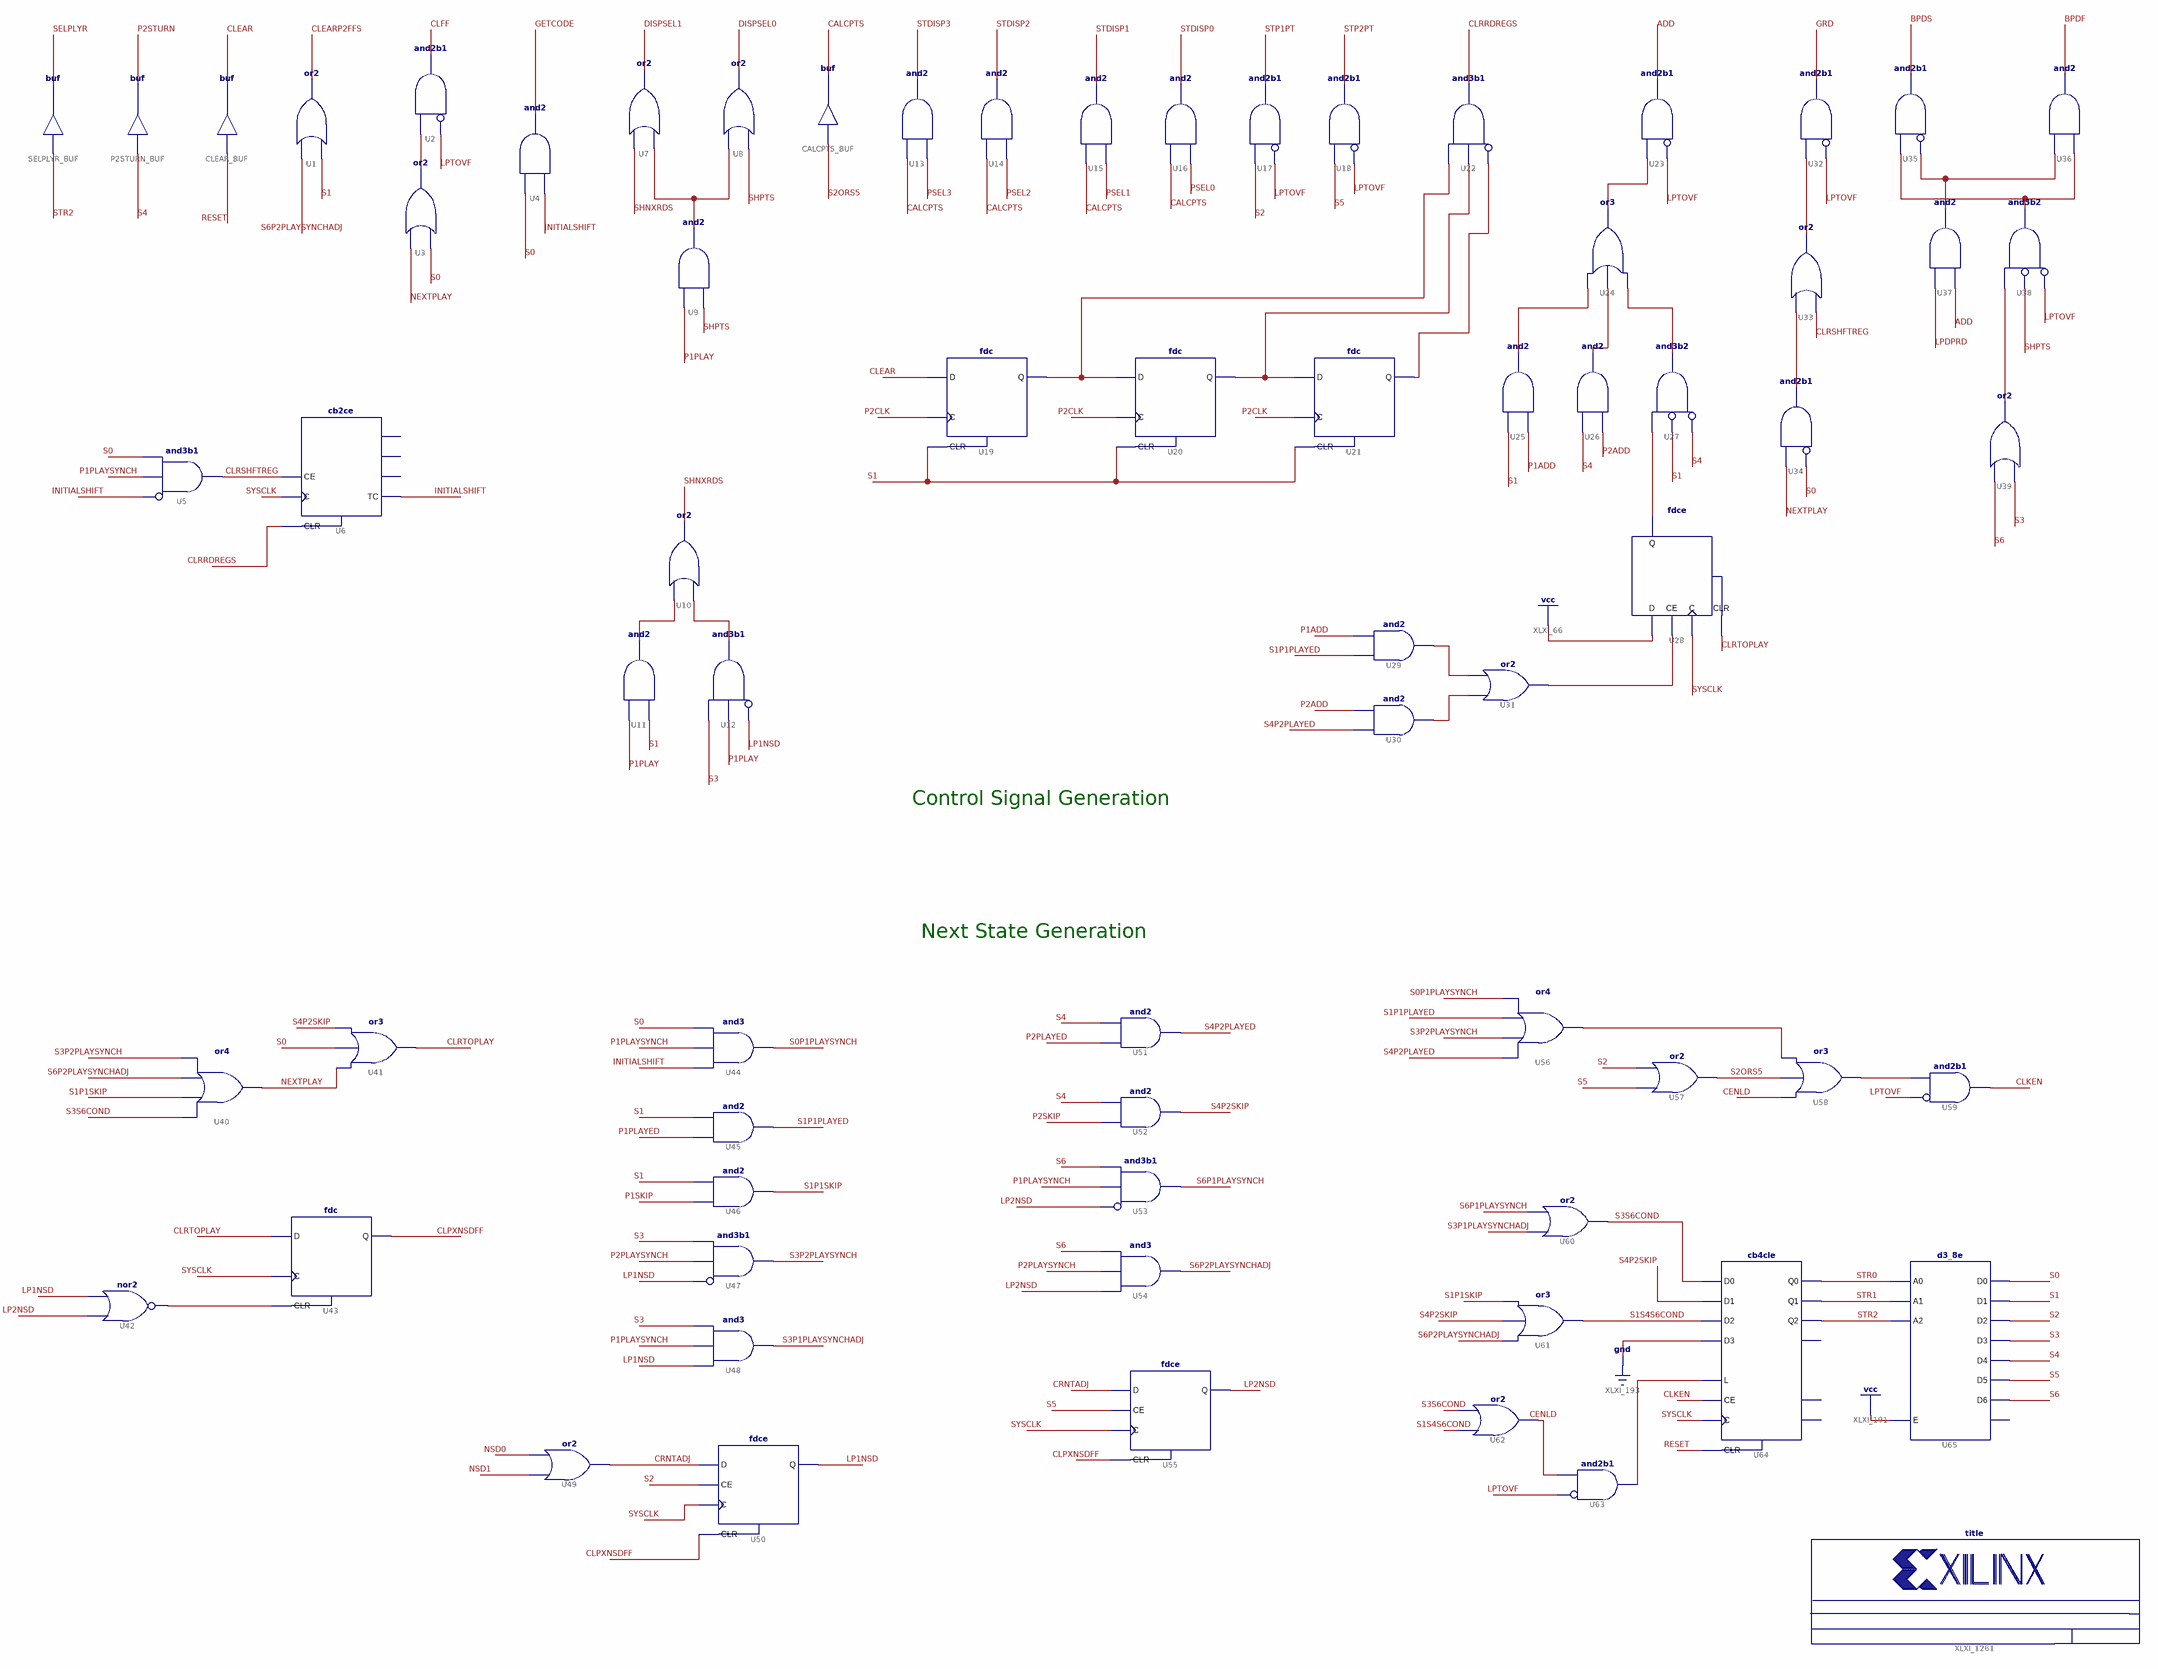
[diagram p0: schematic sheet 1]
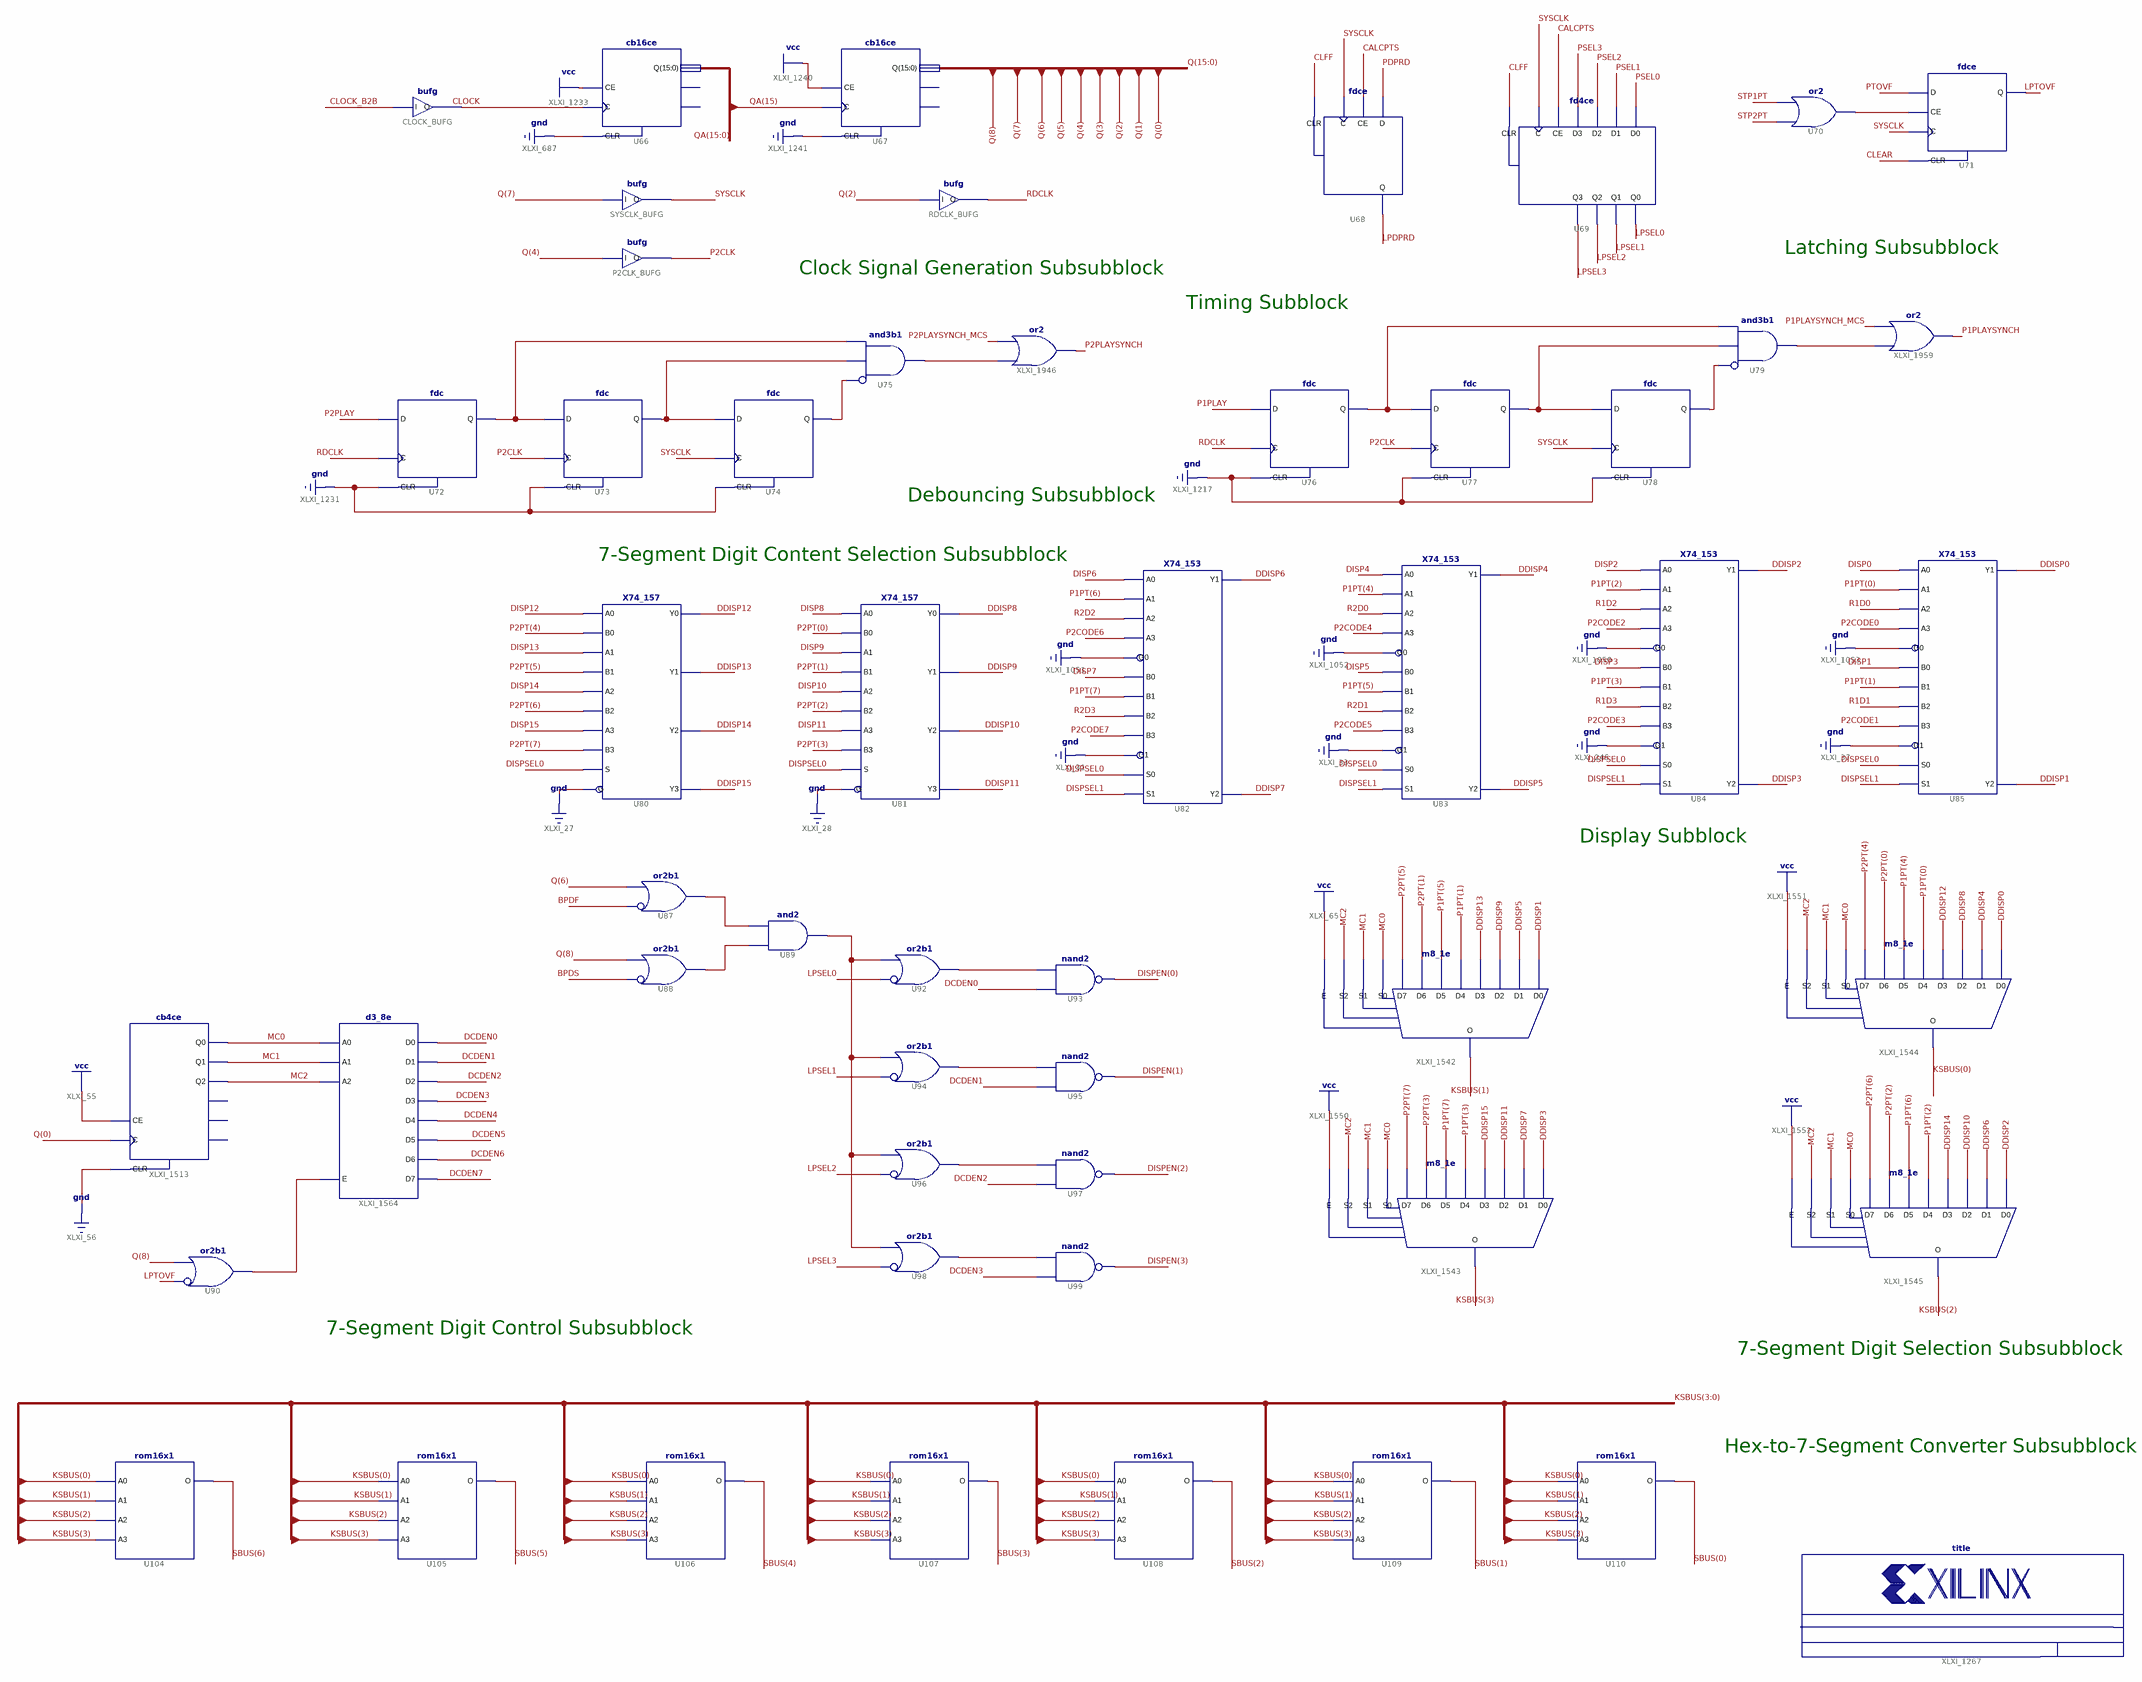
[diagram p1: schematic sheet 2]
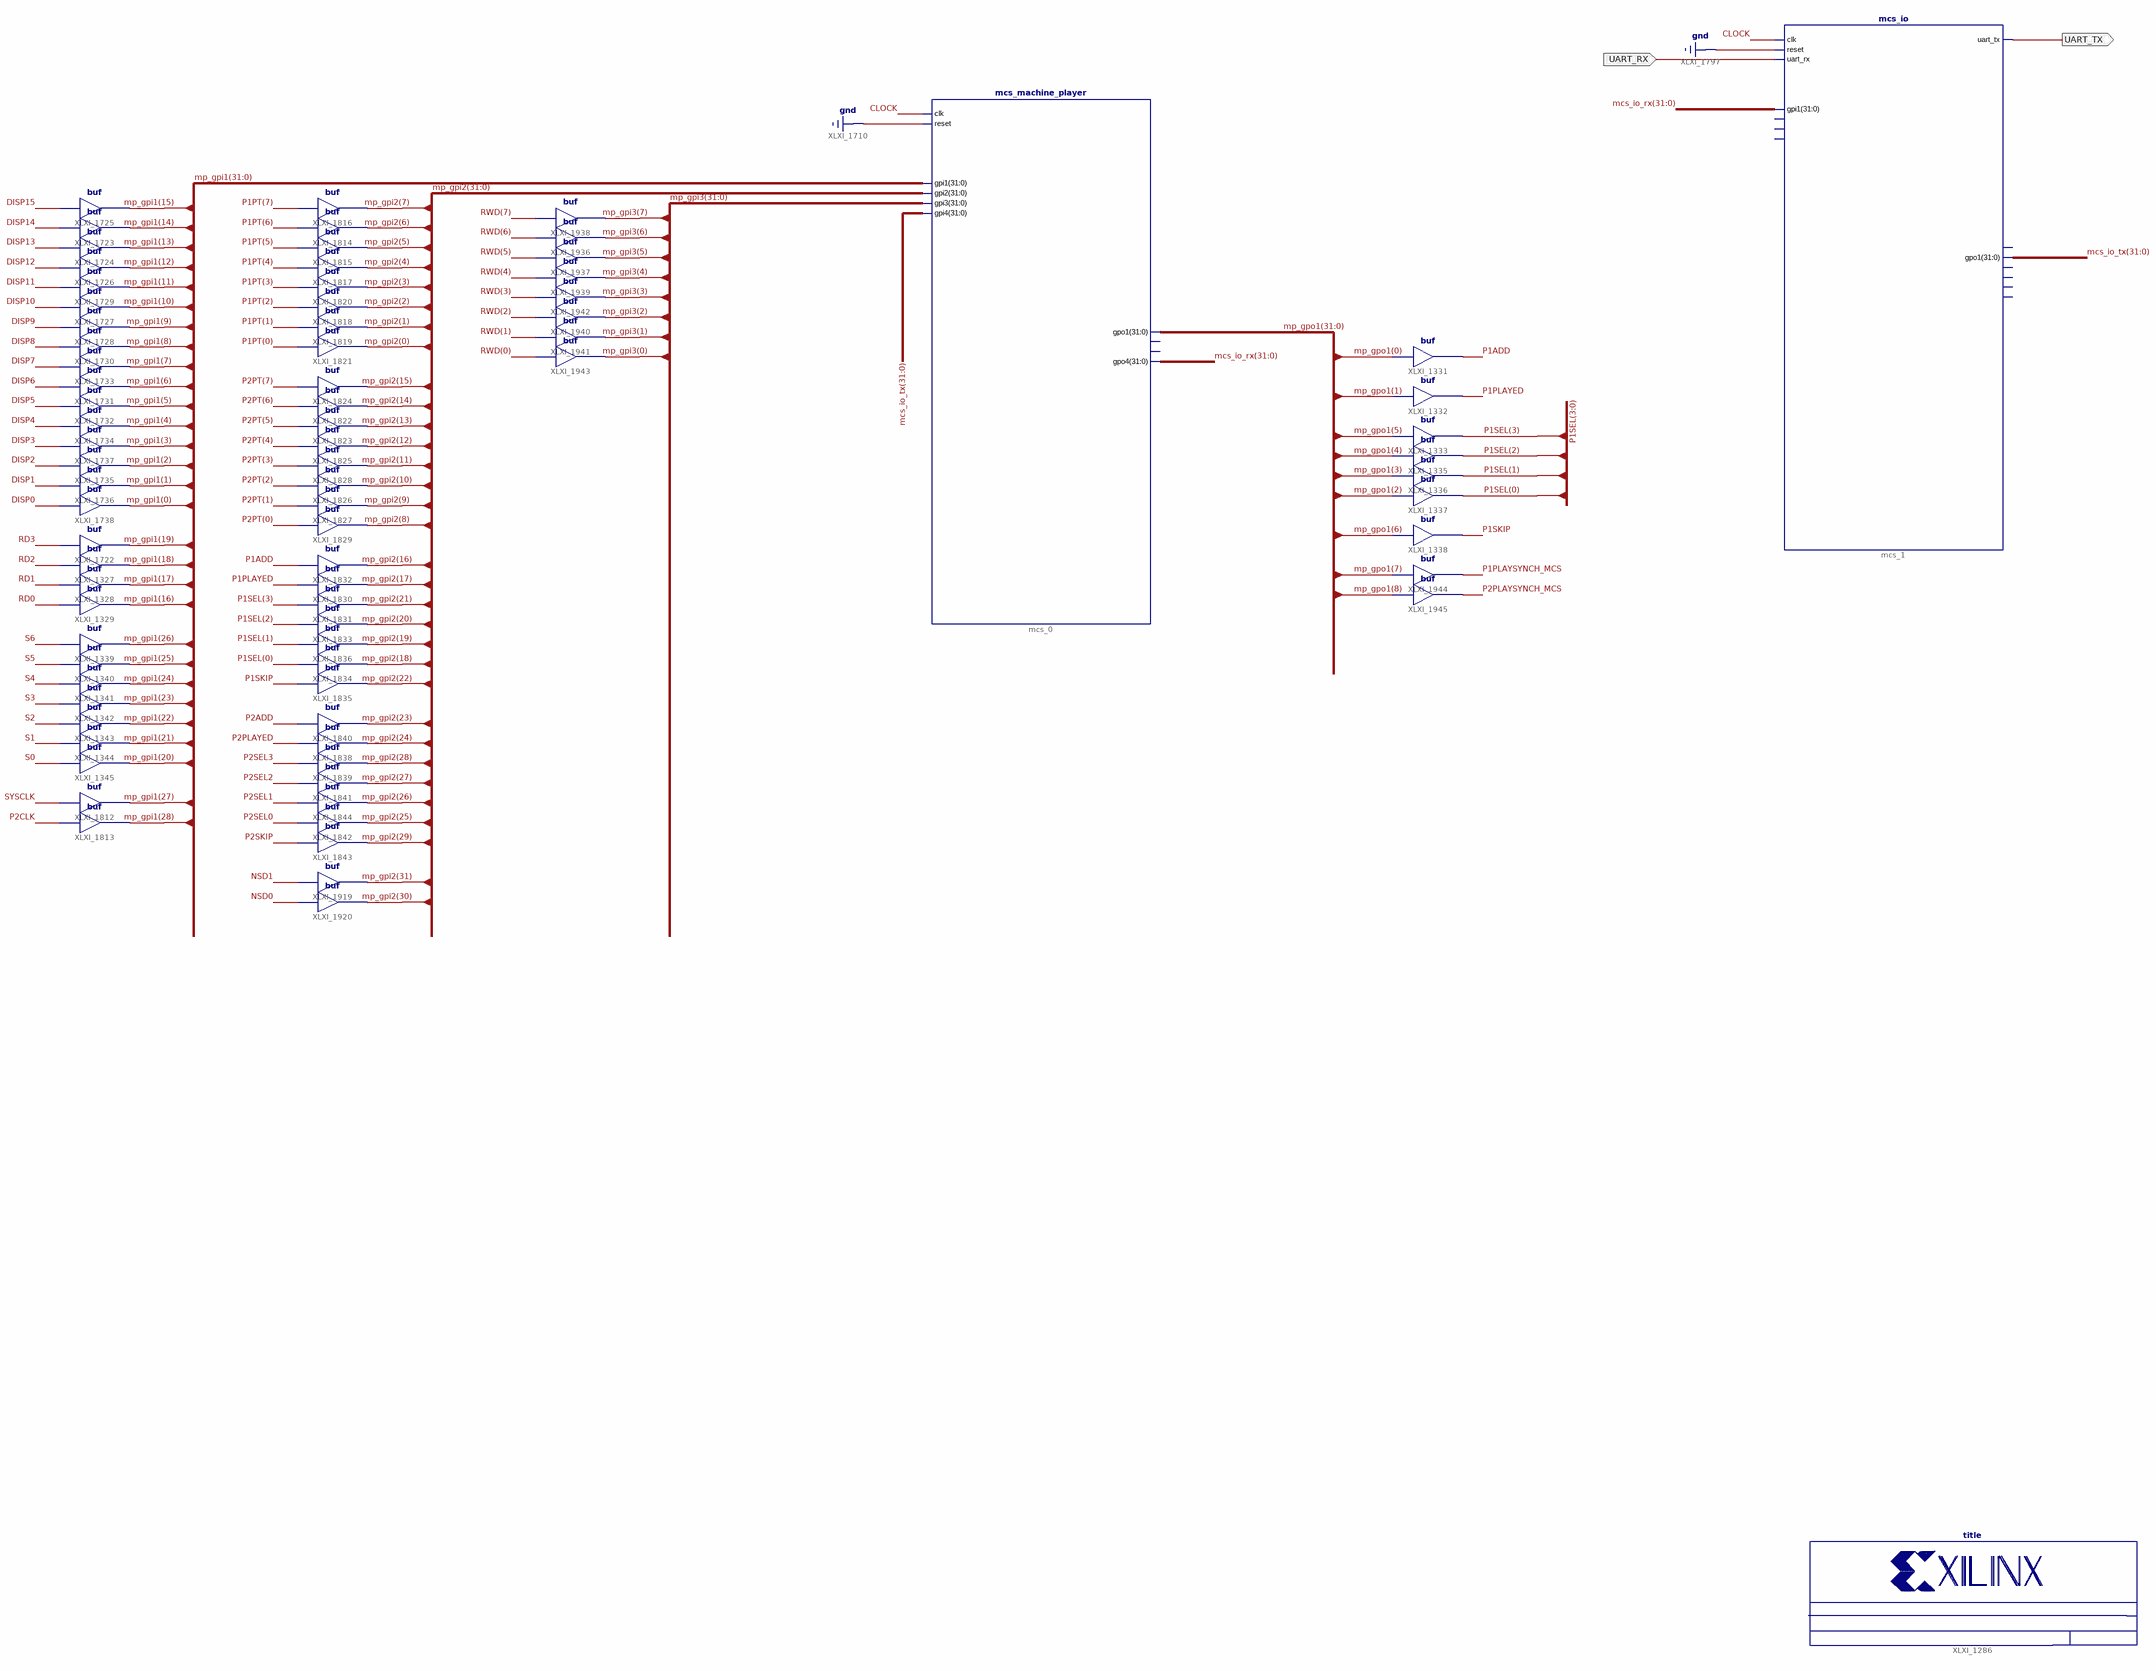
[diagram p2: schematic sheet 3]
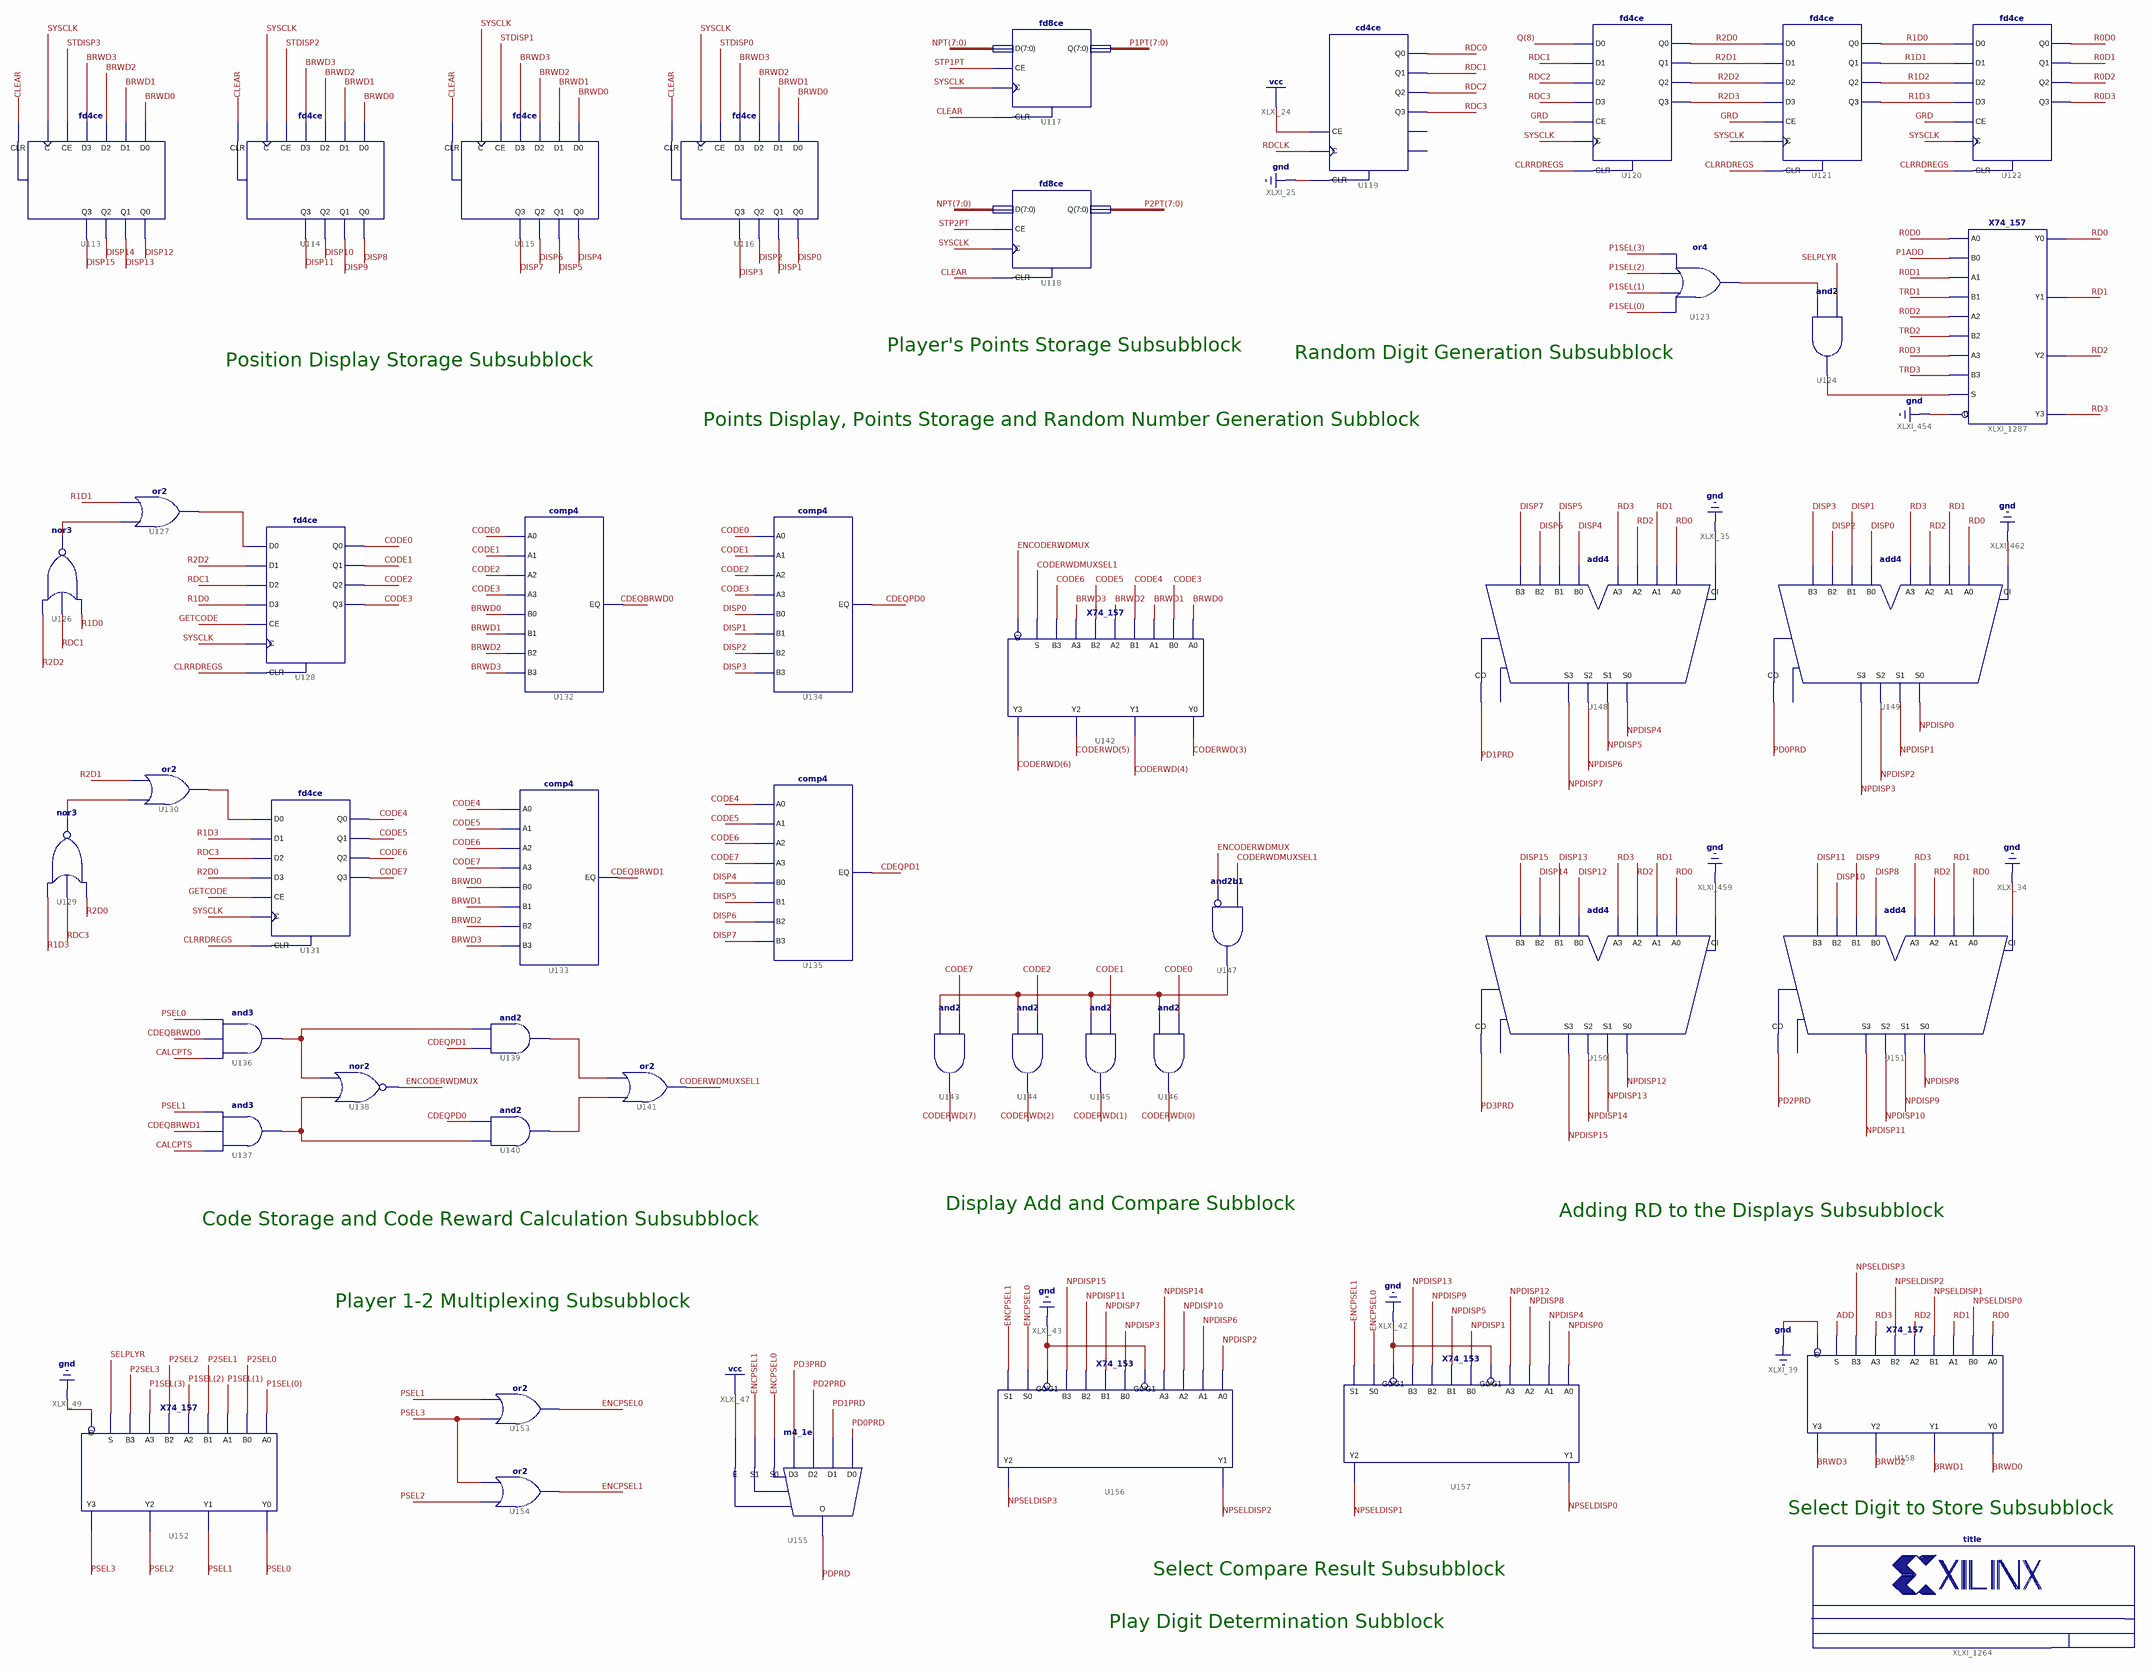
[diagram p3: schematic sheet 4]
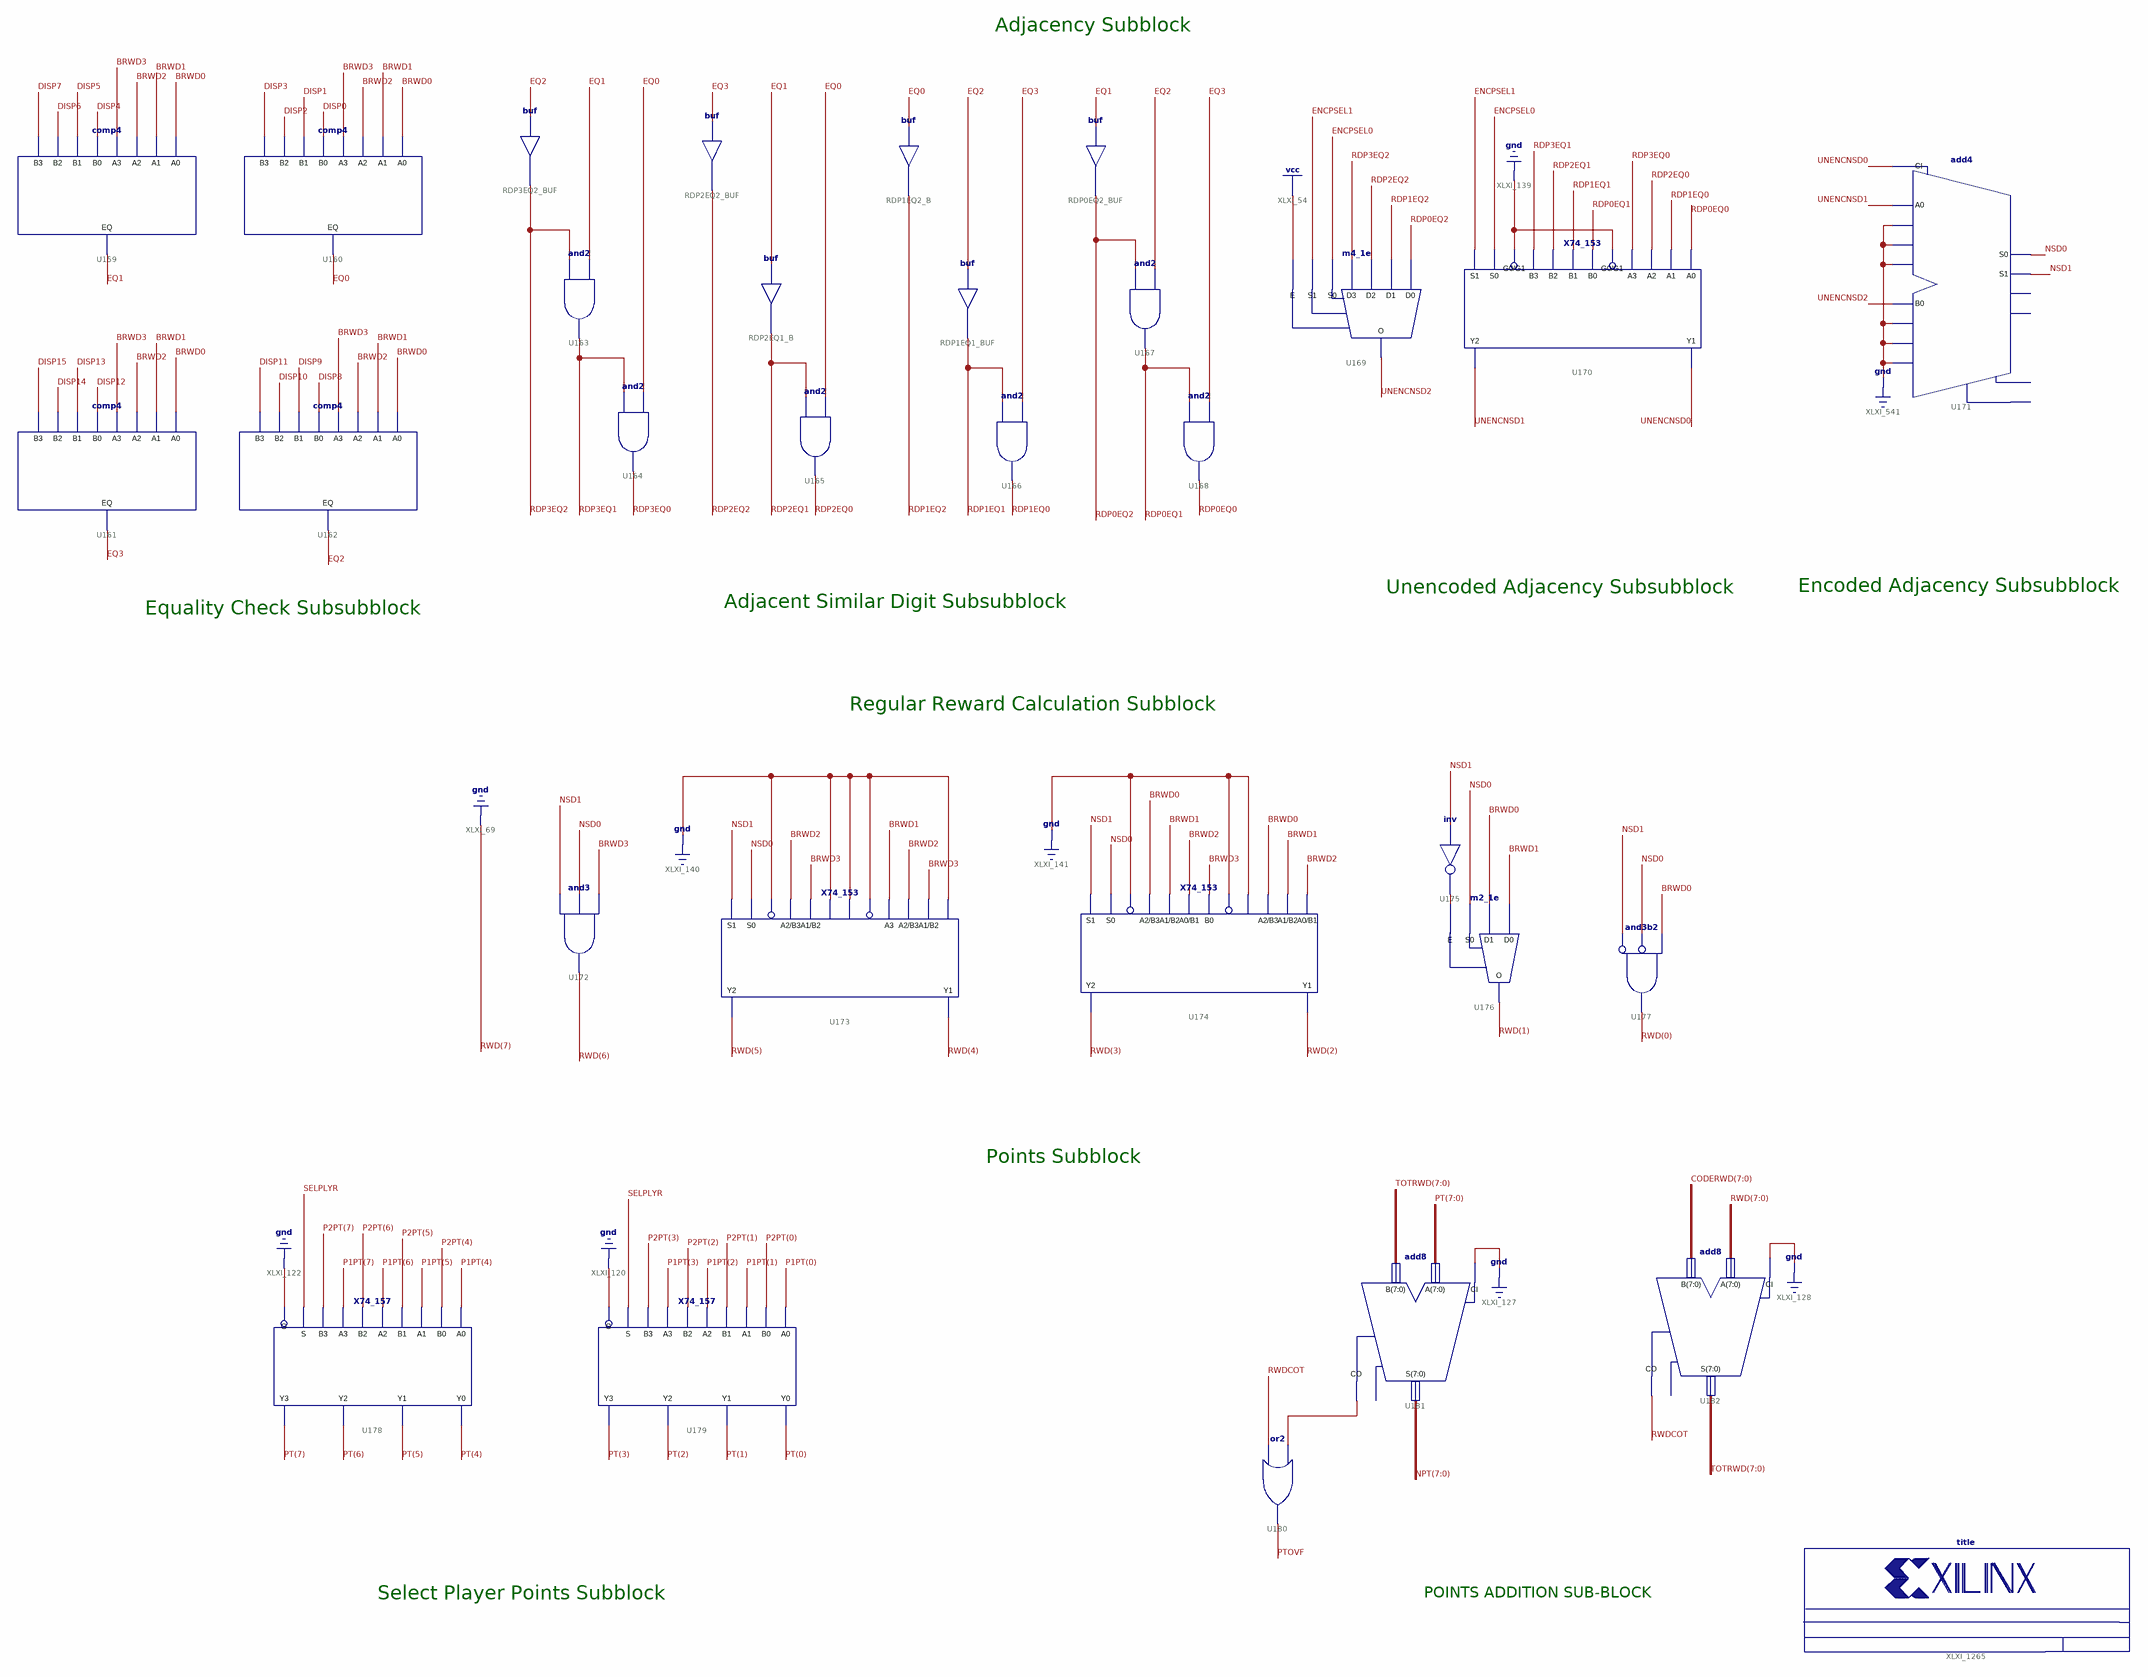
[diagram p4: schematic sheet 5]
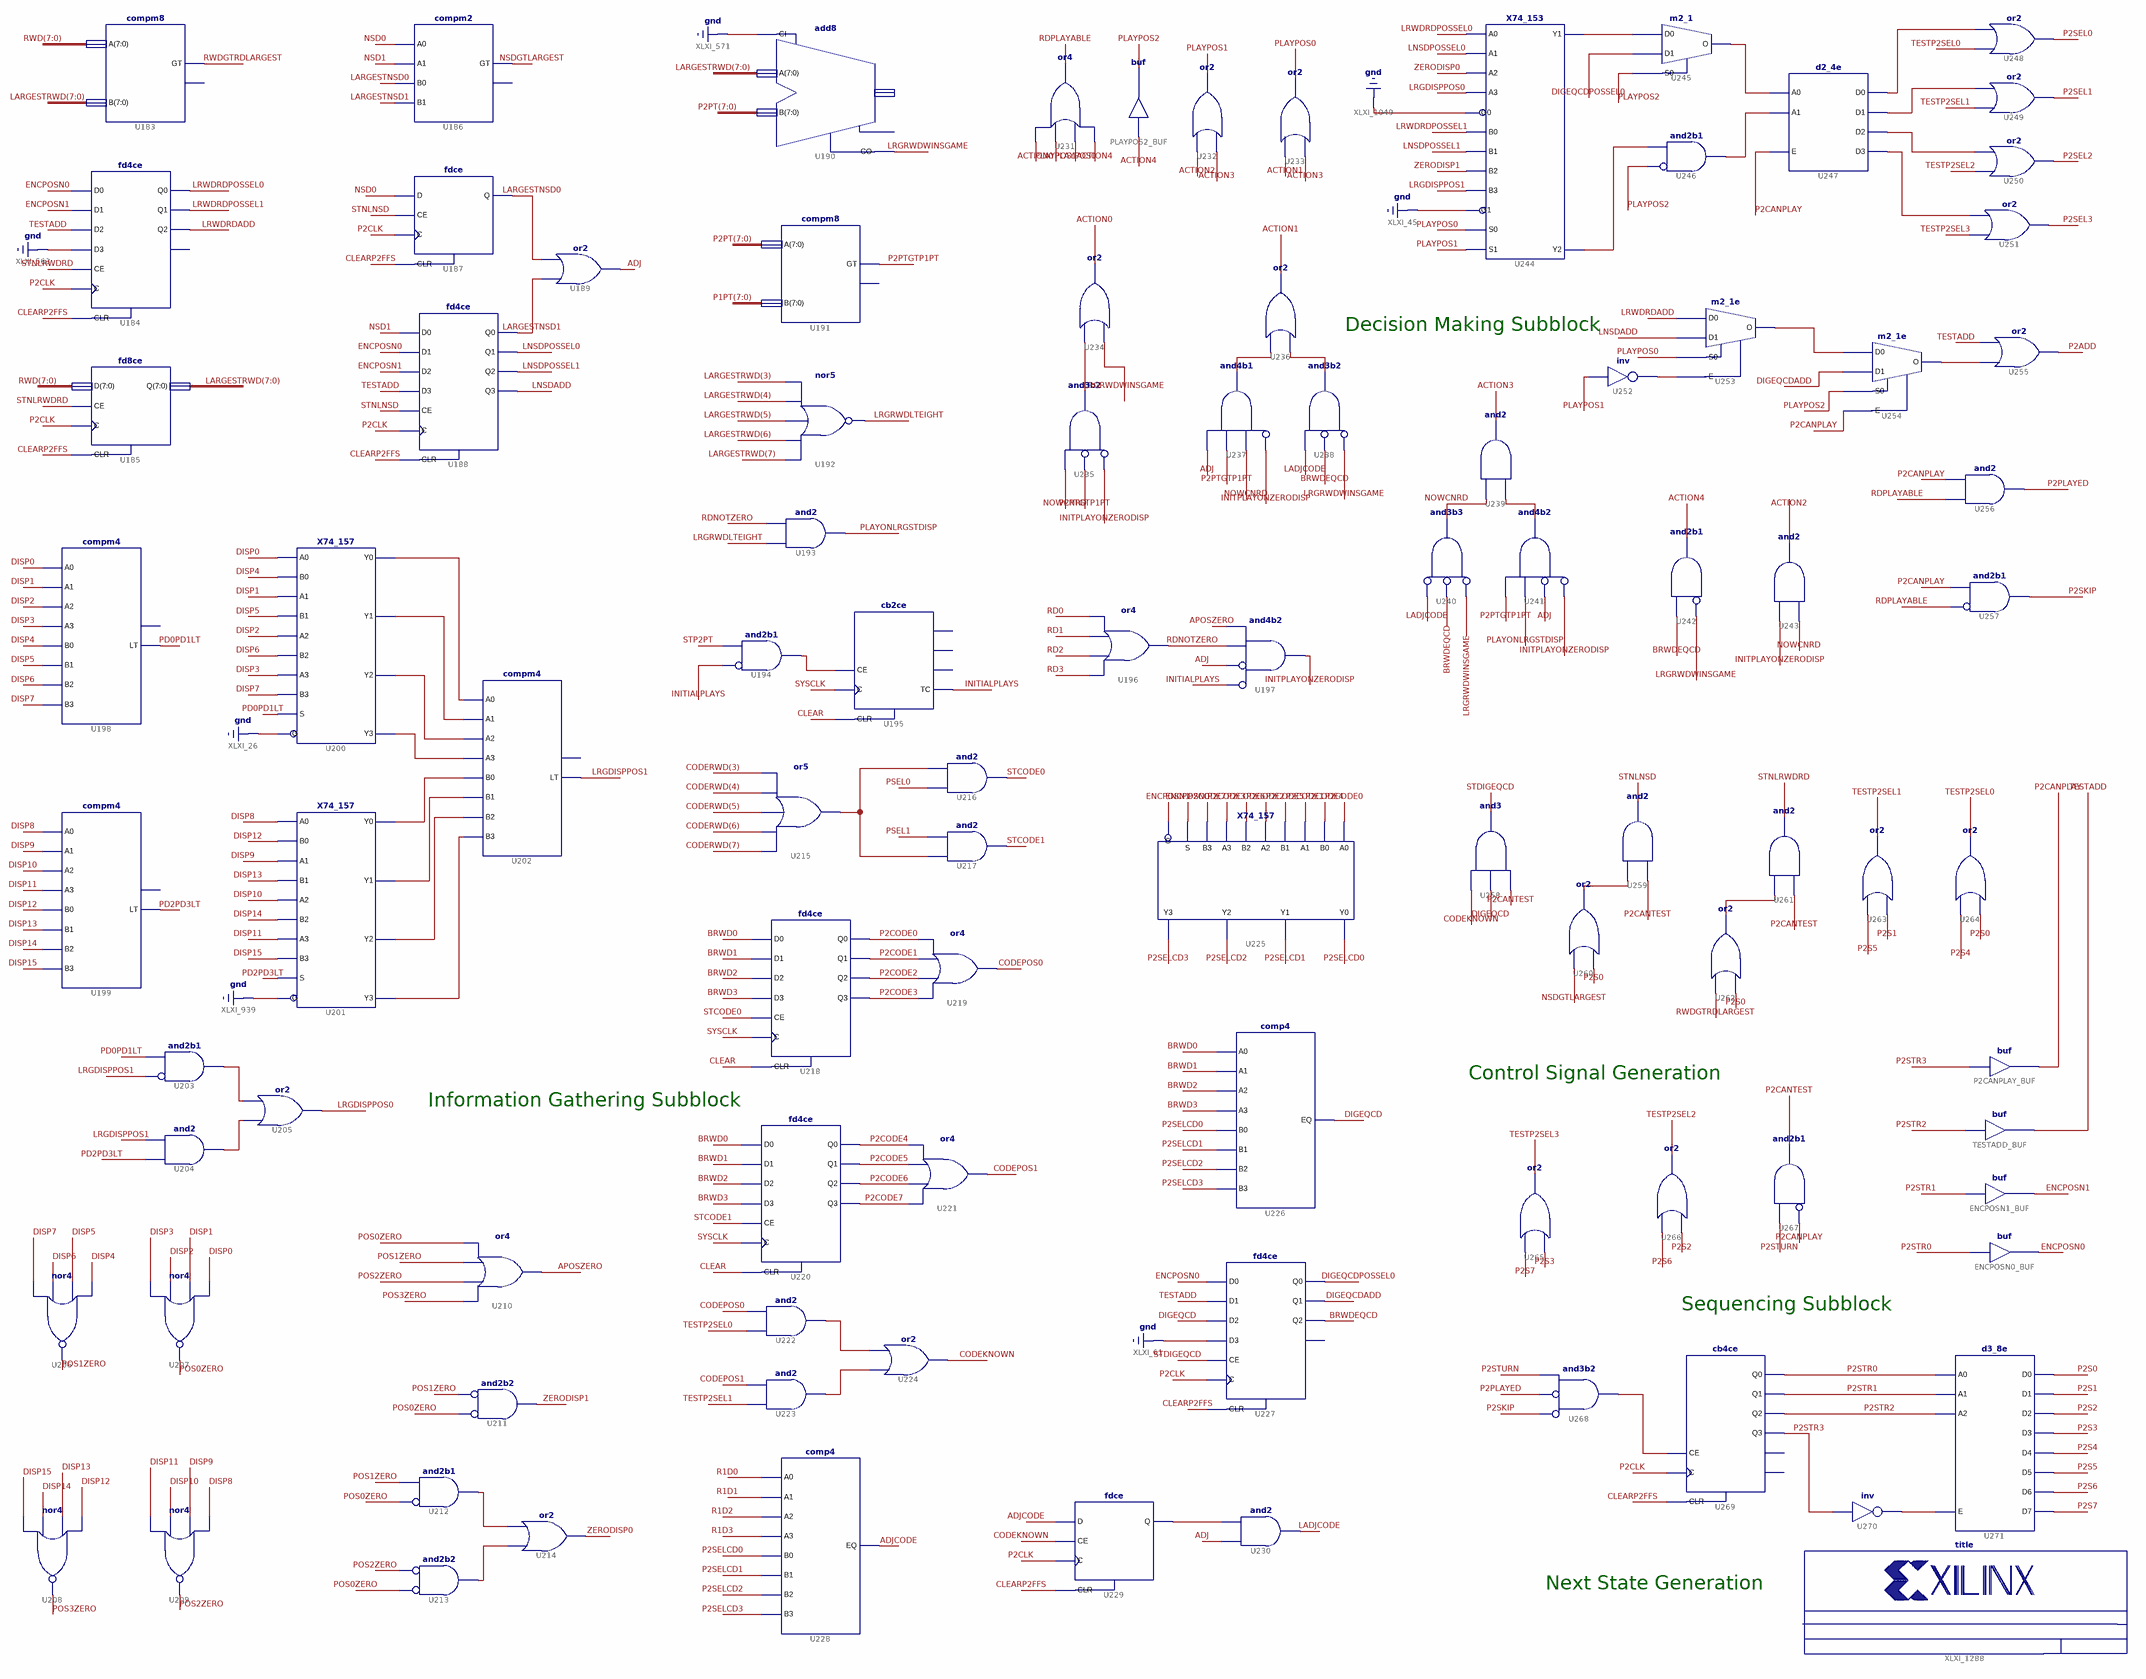
[diagram p5: schematic sheet 6]
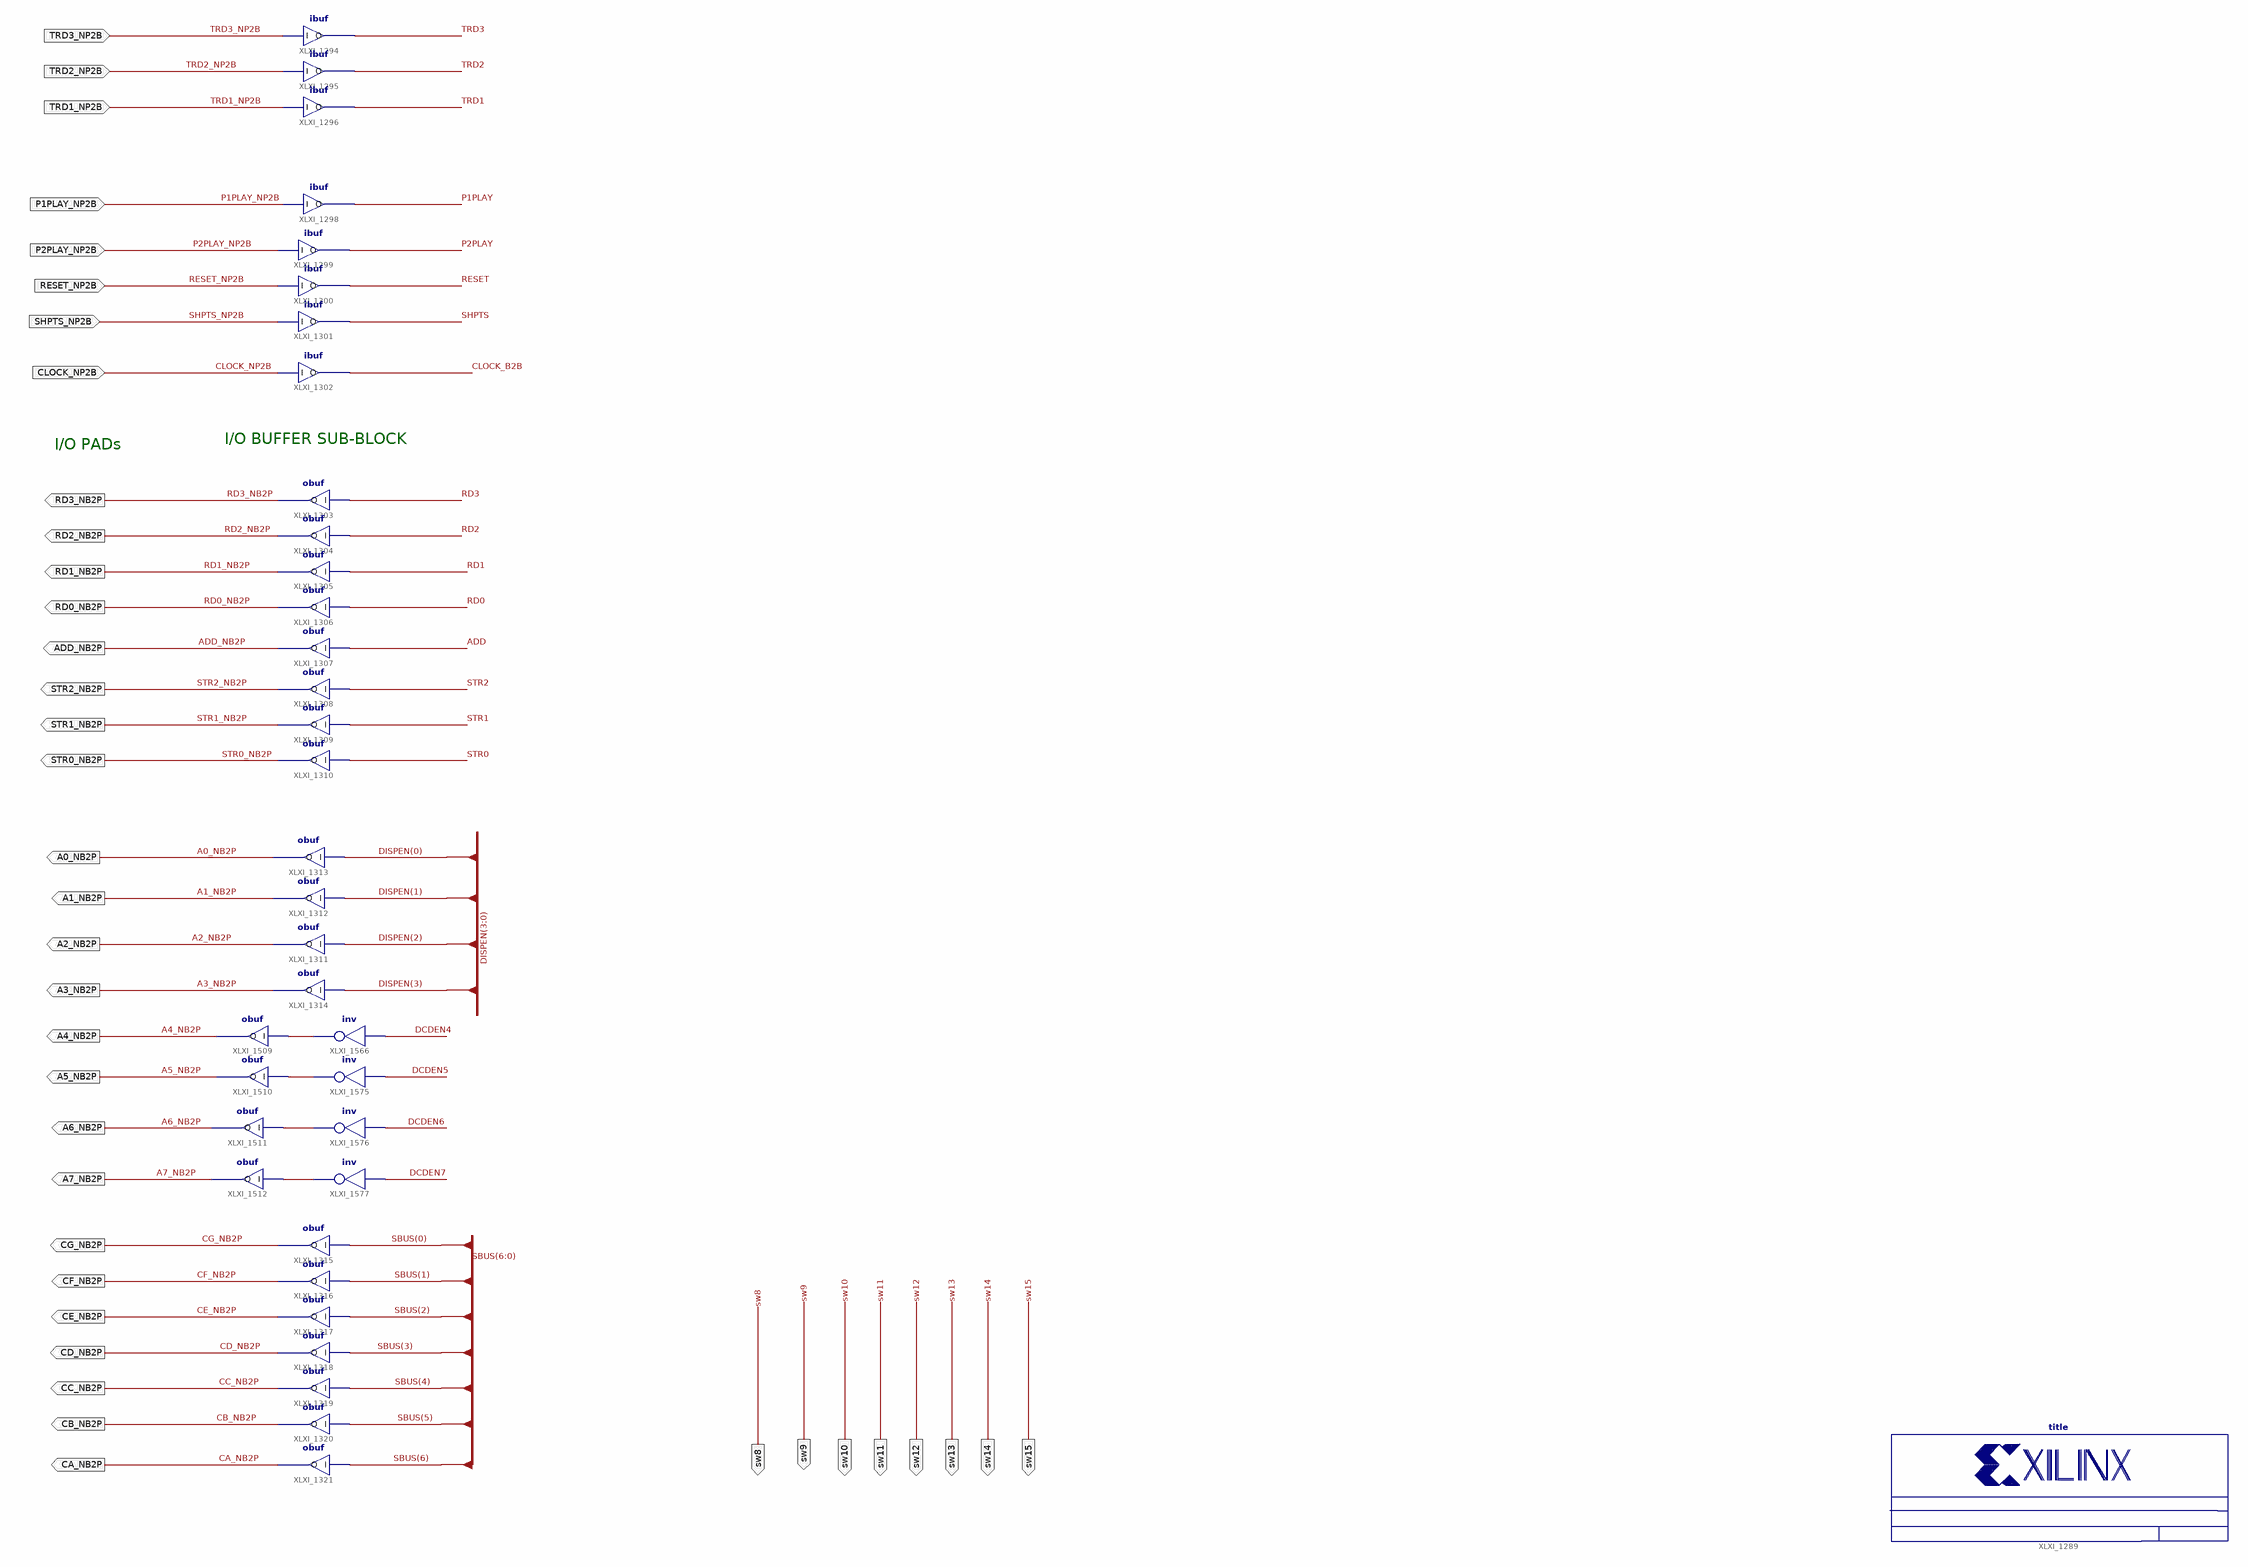
[diagram p6: schematic sheet 7]
// Xilinx ISE schematic ppm.sch (artix7) as structural Verilog: 412 symbols, 41 ports
module ppm (
  input  TRD1_NP2B,
  input  TRD2_NP2B,
  input  TRD3_NP2B,
  input  P1PLAY_NP2B,
  input  RESET_NP2B,
  input  SHPTS_NP2B,
  input  CLOCK_NP2B,
  input  P2PLAY_NP2B,
  input  UART_RX,
  output RD3_NB2P,
  output RD2_NB2P,
  output RD1_NB2P,
  output RD0_NB2P,
  output ADD_NB2P,
  output STR2_NB2P,
  output STR1_NB2P,
  output STR0_NB2P,
  output A4_NB2P,
  output A3_NB2P,
  output A1_NB2P,
  output CG_NB2P,
  output CF_NB2P,
  output CE_NB2P,
  output CD_NB2P,
  output CC_NB2P,
  output CB_NB2P,
  output CA_NB2P,
  output A2_NB2P,
  output A7_NB2P,
  output A6_NB2P,
  output A5_NB2P,
  output A0_NB2P,
  output sw8,
  output sw9,
  output sw10,
  output sw11,
  output sw12,
  output sw13,
  output sw14,
  output sw15,
  output UART_TX
);

  wire ACTION0, ACTION1, ACTION2, ACTION3, ACTION4, ADD, ADJ, ADJCODE, APOSZERO, BPDF, BPDS, BRWD0, BRWD1,
       BRWD2, BRWD3, BRWDEQCD, CALCPTS, CDEQBRWD0, CDEQBRWD1, CDEQPD0, CDEQPD1, CENLD, CLEAR, CLEARP2FFS,
       CLFF, CLKEN, CLOCK, CLOCK_B2B, CLPXNSDFF, CLRRDREGS, CLRSHFTREG, CLRTOPLAY, CODE0, CODE1, CODE2,
       CODE3, CODE4, CODE5, CODE6, CODE7, CODEKNOWN, CODEPOS0, CODEPOS1, CODERWDMUXSEL1, CRNTADJ, DCDEN0,
       DCDEN1, DCDEN2, DCDEN3, DCDEN4, DCDEN5, DCDEN6, DCDEN7, DDISP0, DDISP1, DDISP2, DDISP3, DDISP4,
       DDISP5, DDISP6, DDISP7, DDISP8, DDISP9, DDISP10, DDISP11, DDISP12, DDISP13, DDISP14, DDISP15, DIGEQCD,
       DIGEQCDADD, DIGEQCDPOSSEL0, DISP0, DISP1, DISP2, DISP3, DISP4, DISP5, DISP6, DISP7, DISP8, DISP9,
       DISP10, DISP11, DISP12, DISP13, DISP14, DISP15, DISPSEL0, DISPSEL1, DUMMY_2, ENCODERWDMUX, ENCPOSN0,
       ENCPOSN1, ENCPSEL0, ENCPSEL1, EQ0, EQ1, EQ2, EQ3, GETCODE, GRD, INITIALPLAYS, INITIALSHIFT,
       INITPLAYONZERODISP, INT_NET0, INT_NET1, INT_NET2, INT_NET6, INT_NET8, INT_NET10, INT_NET11, LADJCODE,
       LARGESTNSD0, LARGESTNSD1, LNSDADD, LNSDPOSSEL0, LNSDPOSSEL1, LP1NSD, LP2NSD, LPDPRD, LPSEL0, LPSEL1,
       LPSEL2, LPSEL3, LPTOVF, LRGDISPPOS0, LRGDISPPOS1, LRGRWDLTEIGHT, LRGRWDWINSGAME, LRWDRDADD,
       LRWDRDPOSSEL0, LRWDRDPOSSEL1, MC0, MC1, MC2, NEXTPLAY, NOWCNRD, NPDISP0, NPDISP1, NPDISP2, NPDISP3,
       NPDISP4, NPDISP5, NPDISP6, NPDISP7, NPDISP8, NPDISP9, NPDISP10, NPDISP11, NPDISP12, NPDISP13,
       NPDISP14, NPDISP15, NPSELDISP0, NPSELDISP1, NPSELDISP2, NPSELDISP3, NSD0, NSD1, NSDGTLARGEST, P1ADD,
       P1PLAY, P1PLAYED, P1PLAYSYNCH, P1PLAYSYNCH_MCS, P1SKIP, P2ADD, P2CANPLAY, P2CANTEST, P2CLK, P2CODE0,
       P2CODE1, P2CODE2, P2CODE3, P2CODE4, P2CODE5, P2CODE6, P2CODE7, P2PLAY, P2PLAYED, P2PLAYSYNCH,
       P2PLAYSYNCH_MCS, P2PTGTP1PT, P2S0, P2S1, P2S2, P2S3, P2S4, P2S5, P2S6, P2S7, P2SEL0, P2SEL1, P2SEL2,
       P2SEL3, P2SELCD0, P2SELCD1, P2SELCD2, P2SELCD3, P2SKIP, P2STR0, P2STR1, P2STR2, P2STR3, P2STURN,
       PD0PD1LT, PD0PRD, PD1PRD, PD2PD3LT, PD2PRD, PD3PRD, PDPRD, PLAYONLRGSTDISP, PLAYPOS0, PLAYPOS1,
       PLAYPOS2, POS0ZERO, POS1ZERO, POS2ZERO, POS3ZERO, PSEL0, PSEL1, PSEL2, PSEL3, PTOVF, R0D0, R0D1, R0D2,
       R0D3, R1D0, R1D1, R1D2, R1D3, R2D0, R2D1, R2D2, R2D3, RD0, RD1, RD2, RD3, RDC0, RDC1, RDC2, RDC3,
       RDCLK, RDNOTZERO, RDP0EQ0, RDP0EQ1, RDP0EQ2, RDP1EQ0, RDP1EQ1, RDP1EQ2, RDP2EQ0, RDP2EQ1, RDP2EQ2,
       RDP3EQ0, RDP3EQ1, RDP3EQ2, RDPLAYABLE, RESET, RWDCOT, RWDGTRDLARGEST, S0, S0P1PLAYSYNCH, S1,
       S1P1PLAYED, S1P1SKIP, S1S4S6COND, S2, S2ORS5, S3, S3P1PLAYSYNCHADJ, S3P2PLAYSYNCH, S3S6COND, S4,
       S4P2PLAYED, S4P2SKIP, S5, S6, S6P1PLAYSYNCH, S6P2PLAYSYNCHADJ, SELPLYR, SHNXRDS, SHPTS, STCODE0,
       STCODE1, STDIGEQCD, STDISP0, STDISP1, STDISP2, STDISP3, STNLNSD, STNLRWDRD, STP1PT, STP2PT, STR0,
       STR1, STR2, SYSCLK, TESTADD, TESTP2SEL0, TESTP2SEL1, TESTP2SEL2, TESTP2SEL3, TRD1, TRD2, TRD3,
       UNENCNSD0, UNENCNSD1, UNENCNSD2, XLXN_12, XLXN_19, XLXN_74, XLXN_140, XLXN_141, XLXN_149, XLXN_151,
       XLXN_156, XLXN_163, XLXN_164, XLXN_181, XLXN_188, XLXN_193, XLXN_194, XLXN_195, XLXN_202, XLXN_203,
       XLXN_210, XLXN_460, XLXN_462, XLXN_474, XLXN_1346, XLXN_1347, XLXN_1764, XLXN_1802, XLXN_1891,
       XLXN_1907, XLXN_2029, XLXN_2061, XLXN_2072, XLXN_2186, XLXN_2272, XLXN_2274, XLXN_2275, XLXN_2277,
       XLXN_2304, XLXN_2308, XLXN_2309, XLXN_2310, XLXN_2312, XLXN_2313, XLXN_2331, XLXN_2332, XLXN_2340,
       XLXN_2346, XLXN_2350, XLXN_9551, XLXN_9714, XLXN_10471, XLXN_10478, XLXN_10482, XLXN_10484,
       XLXN_10495, XLXN_10958, XLXN_10960, XLXN_10962, XLXN_11102, XLXN_11265, XLXN_11266, XLXN_11270,
       XLXN_11271, XLXN_11292, XLXN_11294, XLXN_11295, XLXN_11310, XLXN_11347, XLXN_11610, XLXN_11612,
       XLXN_11623, XLXN_11624, XLXN_11625, XLXN_11627, XLXN_11628, XLXN_11644, XLXN_11645, XLXN_11646,
       XLXN_11673, XLXN_11675, XLXN_11808, XLXN_11809, XLXN_12041, XLXN_12042, XLXN_12043, XLXN_12049,
       XLXN_12282, XLXN_12317, ZERODISP0, ZERODISP1;
  wire [3:0] DISPEN, KSBUS, P1SEL;
  wire [6:0] RWD, SBUS;
  wire [7:0] CODERWD, LARGESTRWD, NPT, P1PT, P2PT, PT, TOTRWD;
  wire [15:0] Q, QA;
  wire [31:0] mcs_io_rx, mcs_io_tx, mp_gpi1, mp_gpi2, mp_gpi3, mp_gpo1;

  X74_153 U85 (
    .A0(DISP0), .A1(P1PT[0]), .A2(R1D0), .A3(P2CODE0), .B0(DISP1), .B1(P1PT[1]), .B2(R1D1), .B3(P2CODE1),
    .G0(1'b0), .G1(1'b0), .S0(DISPSEL0), .S1(DISPSEL1), .Y1(DDISP0), .Y2(DDISP1));
  X74_153 U84 (
    .A0(DISP2), .A1(P1PT[2]), .A2(R1D2), .A3(P2CODE2), .B0(DISP3), .B1(P1PT[3]), .B2(R1D3), .B3(P2CODE3),
    .G0(1'b0), .G1(1'b0), .S0(DISPSEL0), .S1(DISPSEL1), .Y1(DDISP2), .Y2(DDISP3));
  X74_153 U83 (
    .A0(DISP4), .A1(P1PT[4]), .A2(R2D0), .A3(P2CODE4), .B0(DISP5), .B1(P1PT[5]), .B2(R2D1), .B3(P2CODE5),
    .G0(1'b0), .G1(1'b0), .S0(DISPSEL0), .S1(DISPSEL1), .Y1(DDISP4), .Y2(DDISP5));
  compm8 U183 (.A({1'b0, RWD}), .B(LARGESTRWD), .GT(RWDGTRDLARGEST));  // open: LT
  fd4ce U184 (
    .C(P2CLK), .CE(STNLRWDRD), .CLR(CLEARP2FFS), .D0(ENCPOSN0), .D1(ENCPOSN1), .D2(TESTADD), .D3(1'b0),
    .Q0(LRWDRDPOSSEL0), .Q1(LRWDRDPOSSEL1), .Q2(LRWDRDADD));  // open: Q3
  fd8ce U185 (.C(P2CLK), .CE(STNLRWDRD), .CLR(CLEARP2FFS), .D({1'b0, RWD}), .Q(LARGESTRWD));
  rom16x1 #(.INIT("2812")) U104 (.A0(KSBUS[0]), .A1(KSBUS[1]), .A2(KSBUS[2]), .A3(KSBUS[3]), .O(SBUS[6]));
  rom16x1 #(.INIT("D860")) U105 (.A0(KSBUS[0]), .A1(KSBUS[1]), .A2(KSBUS[2]), .A3(KSBUS[3]), .O(SBUS[5]));
  rom16x1 #(.INIT("D004")) U106 (.A0(KSBUS[0]), .A1(KSBUS[1]), .A2(KSBUS[2]), .A3(KSBUS[3]), .O(SBUS[4]));
  rom16x1 #(.INIT("8692")) U107 (.A0(KSBUS[0]), .A1(KSBUS[1]), .A2(KSBUS[2]), .A3(KSBUS[3]), .O(SBUS[3]));
  rom16x1 #(.INIT("02BA")) U108 (.A0(KSBUS[0]), .A1(KSBUS[1]), .A2(KSBUS[2]), .A3(KSBUS[3]), .O(SBUS[2]));
  rom16x1 #(.INIT("208E")) U109 (.A0(KSBUS[0]), .A1(KSBUS[1]), .A2(KSBUS[2]), .A3(KSBUS[3]), .O(SBUS[1]));
  rom16x1 #(.INIT("1083")) U110 (.A0(KSBUS[0]), .A1(KSBUS[1]), .A2(KSBUS[2]), .A3(KSBUS[3]), .O(SBUS[0]));
  and U5 (CLRSHFTREG, ~INITIALSHIFT, P1PLAYSYNCH, S0);  // and3b1
  and U29 (XLXN_164, S1P1PLAYED, P1ADD);
  and U30 (XLXN_163, S4P2PLAYED, P2ADD);
  or U31 (INT_NET10, XLXN_163, XLXN_164);
  fdce U28 (.C(SYSCLK), .CE(INT_NET10), .CLR(CLRTOPLAY), .D(1'b1), .Q(XLXN_156));
  and U48 (S3P1PLAYSYNCHADJ, LP1NSD, P1PLAYSYNCH, S3);
  and U47 (S3P2PLAYSYNCH, ~LP1NSD, P2PLAYSYNCH, S3);  // and3b1
  and U46 (S1P1SKIP, P1SKIP, S1);
  and U45 (S1P1PLAYED, P1PLAYED, S1);
  and U44 (S0P1PLAYSYNCH, INITIALSHIFT, P1PLAYSYNCH, S0);
  nor U42 (INT_NET11, LP2NSD, LP1NSD);
  fdc U43 (.C(SYSCLK), .CLR(INT_NET11), .D(CLRTOPLAY), .Q(CLPXNSDFF));
  and U63 (XLXN_474, ~LPTOVF, CENLD);  // and2b1
  or U60 (S3S6COND, S3P1PLAYSYNCHADJ, S6P1PLAYSYNCH);
  cb4cle U64 (
    .C(SYSCLK), .CE(CLKEN), .CLR(RESET), .D0(S3S6COND), .D1(S4P2SKIP), .D2(S1S4S6COND), .D3(1'b0),
    .L(XLXN_474), .Q0(STR0), .Q1(STR1), .Q2(STR2));  // open: CEO, Q3, TC
  d3_8e U65 (
    .A0(STR0), .A1(STR1), .A2(STR2), .E(1'b1), .D0(S0), .D1(S1), .D2(S2), .D3(S3), .D4(S4), .D5(S5), .D6(S6));  // open: D7
  or U40 (NEXTPLAY, S3S6COND, S1P1SKIP, S6P2PLAYSYNCHADJ, S3P2PLAYSYNCH);
  or U41 (CLRTOPLAY, NEXTPLAY, S0, S4P2SKIP);
  d2_4e U247 (
    .A0(XLXN_2309), .A1(XLXN_2310), .E(P2CANPLAY), .D0(XLXN_2331), .D1(XLXN_2312), .D2(XLXN_2313),
    .D3(XLXN_2332));
  X74_153 U244 (
    .A0(LRWDRDPOSSEL0), .A1(LNSDPOSSEL0), .A2(ZERODISP0), .A3(LRGDISPPOS0), .B0(LRWDRDPOSSEL1),
    .B1(LNSDPOSSEL1), .B2(ZERODISP1), .B3(LRGDISPPOS1), .G0(1'b0), .G1(1'b0), .S0(PLAYPOS0), .S1(PLAYPOS1),
    .Y1(XLXN_2304), .Y2(XLXN_2308));
  buf SELPLYR_BUF (SELPLYR, STR2);
  buf P2STURN_BUF (P2STURN, S4);
  or U1 (CLEARP2FFS, S1, S6P2PLAYSYNCHADJ);
  and U2 (CLFF, ~LPTOVF, XLXN_12);  // and2b1
  or U3 (XLXN_12, S0, NEXTPLAY);
  or U7 (DISPSEL1, XLXN_19, SHNXRDS);
  or U8 (DISPSEL0, SHPTS, XLXN_19);
  and U9 (XLXN_19, SHPTS, P1PLAY);
  or U10 (SHNXRDS, XLXN_141, XLXN_140);
  and U11 (XLXN_140, S1, P1PLAY);
  and U12 (XLXN_141, ~LP1NSD, P1PLAY, S3);  // and3b1
  buf CALCPTS_BUF (CALCPTS, S2ORS5);
  and U13 (STDISP3, PSEL3, CALCPTS);
  and U14 (STDISP2, PSEL2, CALCPTS);
  and U36 (BPDF, INT_NET1, INT_NET2);
  and U38 (INT_NET1, ~LPTOVF, ~SHPTS, XLXN_188);  // and3b2
  and U37 (INT_NET2, ADD, LPDPRD);
  and U35 (BPDS, ~INT_NET2, INT_NET1);  // and2b1
  or U33 (INT_NET6, CLRSHFTREG, INT_NET8);
  and U34 (INT_NET8, ~S0, NEXTPLAY);  // and2b1
  and U32 (GRD, ~LPTOVF, INT_NET6);  // and2b1
  and U27 (XLXN_151, ~S4, ~S1, XLXN_156);  // and3b2
  or U24 (XLXN_9551, XLXN_151, XLXN_149, XLXN_9714);
  and U15 (STDISP1, PSEL1, CALCPTS);
  and U25 (XLXN_9714, P1ADD, S1);
  and U26 (XLXN_149, P2ADD, S4);
  or U39 (XLXN_188, S3, S6);
  or U62 (CENLD, S1S4S6COND, S3S6COND);
  fdce U50 (.C(SYSCLK), .CE(S2), .CLR(CLPXNSDFF), .D(CRNTADJ), .Q(LP1NSD));
  or U49 (CRNTADJ, NSD1, NSD0);
  fdce U55 (.C(SYSCLK), .CE(S5), .CLR(CLPXNSDFF), .D(CRNTADJ), .Q(LP2NSD));
  and U54 (S6P2PLAYSYNCHADJ, LP2NSD, P2PLAYSYNCH, S6);
  and U53 (S6P1PLAYSYNCH, ~LP2NSD, P1PLAYSYNCH, S6);  // and3b1
  and U52 (S4P2SKIP, P2SKIP, S4);
  and U51 (S4P2PLAYED, P2PLAYED, S4);
  or U56 (XLXN_460, S4P2PLAYED, S3P2PLAYSYNCH, S1P1PLAYED, S0P1PLAYSYNCH);
  and U59 (CLKEN, ~LPTOVF, XLXN_462);  // and2b1
  or U57 (S2ORS5, S5, S2);
  or U58 (XLXN_462, CENLD, S2ORS5, XLXN_460);
  or U61 (S1S4S6COND, S6P2PLAYSYNCHADJ, S4P2SKIP, S1P1SKIP);
  fd4ce U122 (
    .C(SYSCLK), .CE(GRD), .CLR(CLRRDREGS), .D0(R1D0), .D1(R1D1), .D2(R1D2), .D3(R1D3), .Q0(R0D0), .Q1(R0D1),
    .Q2(R0D2), .Q3(R0D3));
  fd4ce U121 (
    .C(SYSCLK), .CE(GRD), .CLR(CLRRDREGS), .D0(R2D0), .D1(R2D1), .D2(R2D2), .D3(R2D3), .Q0(R1D0), .Q1(R1D1),
    .Q2(R1D2), .Q3(R1D3));
  fd4ce U120 (
    .C(SYSCLK), .CE(GRD), .CLR(CLRRDREGS), .D0(Q[8]), .D1(RDC1), .D2(RDC2), .D3(RDC3), .Q0(R2D0), .Q1(R2D1),
    .Q2(R2D2), .Q3(R2D3));
  or U123 (XLXN_1347, P1SEL[0], P1SEL[1], P1SEL[2], P1SEL[3]);
  and U124 (XLXN_1346, XLXN_1347, SELPLYR);
  cd4ce U119 (.C(RDCLK), .CE(1'b1), .CLR(1'b0), .Q0(RDC0), .Q1(RDC1), .Q2(RDC2), .Q3(RDC3));  // open: CEO, TC
  fd8ce U117 (.C(SYSCLK), .CE(STP1PT), .CLR(CLEAR), .D(NPT), .Q(P1PT));
  fd8ce U118 (.C(SYSCLK), .CE(STP2PT), .CLR(CLEAR), .D(NPT), .Q(P2PT));
  m4_1e U155 (.D0(PD0PRD), .D1(PD1PRD), .D2(PD2PRD), .D3(PD3PRD), .E(1'b1), .S0(ENCPSEL0), .S1(ENCPSEL1), .O(PDPRD));
  or U153 (ENCPSEL0, PSEL3, PSEL1);
  or U154 (ENCPSEL1, PSEL2, PSEL3);
  X74_153 U157 (
    .A0(NPDISP0), .A1(NPDISP4), .A2(NPDISP8), .A3(NPDISP12), .B0(NPDISP1), .B1(NPDISP5), .B2(NPDISP9),
    .B3(NPDISP13), .G0(1'b0), .G1(1'b0), .S0(ENCPSEL0), .S1(ENCPSEL1), .Y1(NPSELDISP0), .Y2(NPSELDISP1));
  X74_153 U156 (
    .A0(NPDISP2), .A1(NPDISP6), .A2(NPDISP10), .A3(NPDISP14), .B0(NPDISP3), .B1(NPDISP7), .B2(NPDISP11),
    .B3(NPDISP15), .G0(1'b0), .G1(1'b0), .S0(ENCPSEL0), .S1(ENCPSEL1), .Y1(NPSELDISP2), .Y2(NPSELDISP3));
  fd4ce U113 (
    .C(SYSCLK), .CE(STDISP3), .CLR(CLEAR), .D0(BRWD0), .D1(BRWD1), .D2(BRWD2), .D3(BRWD3), .Q0(DISP12),
    .Q1(DISP13), .Q2(DISP14), .Q3(DISP15));
  fd4ce U114 (
    .C(SYSCLK), .CE(STDISP2), .CLR(CLEAR), .D0(BRWD0), .D1(BRWD1), .D2(BRWD2), .D3(BRWD3), .Q0(DISP8),
    .Q1(DISP9), .Q2(DISP10), .Q3(DISP11));
  fd4ce U115 (
    .C(SYSCLK), .CE(STDISP1), .CLR(CLEAR), .D0(BRWD0), .D1(BRWD1), .D2(BRWD2), .D3(BRWD3), .Q0(DISP4),
    .Q1(DISP5), .Q2(DISP6), .Q3(DISP7));
  fd4ce U116 (
    .C(SYSCLK), .CE(STDISP0), .CLR(CLEAR), .D0(BRWD0), .D1(BRWD1), .D2(BRWD2), .D3(BRWD3), .Q0(DISP0),
    .Q1(DISP1), .Q2(DISP2), .Q3(DISP3));
  compm2 U186 (.A0(NSD0), .A1(NSD1), .B0(LARGESTNSD0), .B1(LARGESTNSD1), .GT(NSDGTLARGEST));  // open: LT
  or U189 (ADJ, LARGESTNSD1, LARGESTNSD0);
  fdce U187 (.C(P2CLK), .CE(STNLNSD), .CLR(CLEARP2FFS), .D(NSD0), .Q(LARGESTNSD0));
  fd4ce U188 (
    .C(P2CLK), .CE(STNLNSD), .CLR(CLEARP2FFS), .D0(NSD1), .D1(ENCPOSN0), .D2(ENCPOSN1), .D3(TESTADD),
    .Q0(LARGESTNSD1), .Q1(LNSDPOSSEL0), .Q2(LNSDPOSSEL1), .Q3(LNSDADD));
  cb4ce U269 (
    .C(P2CLK), .CE(XLXN_2072), .CLR(CLEARP2FFS), .Q0(P2STR0), .Q1(P2STR1), .Q2(P2STR2), .Q3(P2STR3));  // open: CEO, TC
  and U268 (XLXN_2072, ~P2SKIP, ~P2PLAYED, P2STURN);  // and3b2
  not U270 (XLXN_2061, P2STR3);
  d3_8e U271 (
    .A0(P2STR0), .A1(P2STR1), .A2(P2STR2), .E(XLXN_2061), .D0(P2S0), .D1(P2S1), .D2(P2S2), .D3(P2S3),
    .D4(P2S4), .D5(P2S5), .D6(P2S6), .D7(P2S7));
  buf ENCPOSN0_BUF (ENCPOSN0, P2STR0);
  buf ENCPOSN1_BUF (ENCPOSN1, P2STR1);
  buf P2CANPLAY_BUF (P2CANPLAY, P2STR3);
  buf TESTADD_BUF (TESTADD, P2STR2);
  or U264 (TESTP2SEL0, P2S0, P2S4);
  or U263 (TESTP2SEL1, P2S1, P2S5);
  and U259 (STNLNSD, P2CANTEST, XLXN_1891);
  and U258 (STDIGEQCD, P2CANTEST, DIGEQCD, CODEKNOWN);
  and U261 (STNLRWDRD, P2CANTEST, XLXN_1907);
  or U262 (XLXN_1907, P2S0, RWDGTRDLARGEST);
  or U260 (XLXN_1891, P2S0, NSDGTLARGEST);
  or U266 (TESTP2SEL2, P2S2, P2S6);
  and U267 (P2CANTEST, ~P2CANPLAY, P2STURN);  // and2b1
  or U265 (TESTP2SEL3, P2S3, P2S7);
  and U194 (XLXN_2029, ~INITIALPLAYS, STP2PT);  // and2b1
  cb2ce U195 (.C(SYSCLK), .CE(XLXN_2029), .CLR(CLEAR), .TC(INITIALPLAYS));  // open: CEO, Q0, Q1
  nor U192 (LRGRWDLTEIGHT, LARGESTRWD[7], LARGESTRWD[6], LARGESTRWD[5], LARGESTRWD[4], LARGESTRWD[3]);
  and U193 (PLAYONLRGSTDISP, LRGRWDLTEIGHT, RDNOTZERO);
  and U257 (P2SKIP, ~RDPLAYABLE, P2CANPLAY);  // and2b1
  and U256 (P2PLAYED, RDPLAYABLE, P2CANPLAY);
  m2_1e U254 (.D0(XLXN_2346), .D1(DIGEQCDADD), .E(P2CANPLAY), .S0(PLAYPOS2), .O(XLXN_2340));
  or U255 (P2ADD, XLXN_2340, TESTADD);
  not U252 (XLXN_2350, PLAYPOS1);
  m2_1e U253 (.D0(LRWDRDADD), .D1(LNSDADD), .E(XLXN_2350), .S0(PLAYPOS0), .O(XLXN_2346));
  or U249 (P2SEL1, TESTP2SEL1, XLXN_2312);
  or U250 (P2SEL2, TESTP2SEL2, XLXN_2313);
  or U251 (P2SEL3, TESTP2SEL3, XLXN_2332);
  or U248 (P2SEL0, TESTP2SEL0, XLXN_2331);
  and U246 (XLXN_2310, ~PLAYPOS2, XLXN_2308);  // and2b1
  m2_1 U245 (.D0(XLXN_2304), .D1(DIGEQCDPOSSEL0), .S0(PLAYPOS2), .O(XLXN_2309));
  or U233 (PLAYPOS0, ACTION3, ACTION1);
  buf PLAYPOS2_BUF (PLAYPOS2, ACTION4);
  or U231 (RDPLAYABLE, ACTION4, PLAYPOS0, PLAYPOS1, ACTION0);
  or U232 (PLAYPOS1, ACTION3, ACTION2);
  or U236 (ACTION1, XLXN_2275, XLXN_2274);
  and U237 (XLXN_2274, ~INITPLAYONZERODISP, NOWCNRD, P2PTGTP1PT, ADJ);  // and4b1
  and U238 (XLXN_2275, ~LRGRWDWINSGAME, ~BRWDEQCD, LADJCODE);  // and3b2
  and U235 (XLXN_2272, ~INITPLAYONZERODISP, ~P2PTGTP1PT, NOWCNRD);  // and3b2
  or U234 (ACTION0, LRGRWDWINSGAME, XLXN_2272);
  add8 U190 (.A(LARGESTRWD), .B(P2PT), .CI(1'b0), .CO(LRGRWDWINSGAME));  // open: OFL, S
  compm8 U191 (.A(P2PT), .B(P1PT), .GT(P2PTGTP1PT));  // open: LT
  comp4 U228 (
    .A0(R1D0), .A1(R1D1), .A2(R1D2), .A3(R1D3), .B0(P2SELCD0), .B1(P2SELCD1), .B2(P2SELCD2), .B3(P2SELCD3),
    .EQ(ADJCODE));
  and U230 (LADJCODE, ADJ, XLXN_2186);
  fdce U229 (.C(P2CLK), .CE(CODEKNOWN), .CLR(CLEARP2FFS), .D(ADJCODE), .Q(XLXN_2186));
  and U197 (INITPLAYONZERODISP, ~INITIALPLAYS, ~ADJ, RDNOTZERO, APOSZERO);  // and4b2
  or U196 (RDNOTZERO, RD3, RD2, RD1, RD0);
  and U243 (ACTION2, NOWCNRD, INITPLAYONZERODISP);
  and U242 (ACTION4, ~LRGRWDWINSGAME, BRWDEQCD);  // and2b1
  and U239 (ACTION3, XLXN_2277, NOWCNRD);
  and U241 (XLXN_2277, ~INITPLAYONZERODISP, ~ADJ, PLAYONLRGSTDISP, P2PTGTP1PT);  // and4b2
  and U240 (NOWCNRD, ~LRGRWDWINSGAME, ~BRWDEQCD, ~LADJCODE);  // and3b3
  and U18 (STP2PT, ~LPTOVF, S5);  // and2b1
  and U17 (STP1PT, ~LPTOVF, S2);  // and2b1
  and U16 (STDISP0, PSEL0, CALCPTS);
  and U4 (GETCODE, INITIALSHIFT, S0);
  cb2ce U6 (.C(SYSCLK), .CE(CLRSHFTREG), .CLR(CLRRDREGS), .TC(INITIALSHIFT));  // open: CEO, Q0, Q1
  buf CLEAR_BUF (CLEAR, RESET);
  cb16ce U66 (.C(CLOCK), .CE(1'b1), .CLR(1'b0), .Q(QA));  // open: CEO, TC
  cb16ce U67 (.C(QA[15]), .CE(1'b1), .CLR(1'b0), .Q(Q));  // open: CEO, TC
  bufg RDCLK_BUFG (.I(Q[2]), .O(RDCLK));
  bufg SYSCLK_BUFG (.I(Q[7]), .O(SYSCLK));
  bufg P2CLK_BUFG (.I(Q[4]), .O(P2CLK));
  and U22 (CLRRDREGS, ~XLXN_11102, XLXN_10478, XLXN_10471);  // and3b1
  and U23 (ADD, ~LPTOVF, XLXN_9551);  // and2b1
  fdc U19 (.C(P2CLK), .CLR(S1), .D(CLEAR), .Q(XLXN_10471));
  fdc U21 (.C(P2CLK), .CLR(S1), .D(XLXN_10478), .Q(XLXN_11102));
  fdc U20 (.C(P2CLK), .CLR(S1), .D(XLXN_10471), .Q(XLXN_10478));
  fdce U71 (.C(SYSCLK), .CE(XLXN_74), .CLR(CLEAR), .D(PTOVF), .Q(LPTOVF));
  fd4ce U69 (
    .C(SYSCLK), .CE(CALCPTS), .CLR(CLFF), .D0(PSEL0), .D1(PSEL1), .D2(PSEL2), .D3(PSEL3), .Q0(LPSEL0),
    .Q1(LPSEL1), .Q2(LPSEL2), .Q3(LPSEL3));
  fdce U68 (.C(SYSCLK), .CE(CALCPTS), .CLR(CLFF), .D(PDPRD), .Q(LPDPRD));
  or U70 (XLXN_74, STP2PT, STP1PT);
  add4 U150 (
    .A0(RD0), .A1(RD1), .A2(RD2), .A3(RD3), .B0(DISP12), .B1(DISP13), .B2(DISP14), .B3(DISP15), .CI(1'b0),
    .CO(PD3PRD), .S0(NPDISP12), .S1(NPDISP13), .S2(NPDISP14), .S3(NPDISP15));  // open: OFL
  add4 U151 (
    .A0(RD0), .A1(RD1), .A2(RD2), .A3(RD3), .B0(DISP8), .B1(DISP9), .B2(DISP10), .B3(DISP11), .CI(1'b0),
    .CO(PD2PRD), .S0(NPDISP8), .S1(NPDISP9), .S2(NPDISP10), .S3(NPDISP11));  // open: OFL
  add4 U149 (
    .A0(RD0), .A1(RD1), .A2(RD2), .A3(RD3), .B0(DISP0), .B1(DISP1), .B2(DISP2), .B3(DISP3), .CI(1'b0),
    .CO(PD0PRD), .S0(NPDISP0), .S1(NPDISP1), .S2(NPDISP2), .S3(NPDISP3));  // open: OFL
  add4 U148 (
    .A0(RD0), .A1(RD1), .A2(RD2), .A3(RD3), .B0(DISP4), .B1(DISP5), .B2(DISP6), .B3(DISP7), .CI(1'b0),
    .CO(PD1PRD), .S0(NPDISP4), .S1(NPDISP5), .S2(NPDISP6), .S3(NPDISP7));  // open: OFL
  and U136 (XLXN_11265, CALCPTS, CDEQBRWD0, PSEL0);
  nor U138 (ENCODERWDMUX, XLXN_11266, XLXN_11265);
  and U139 (XLXN_11270, CDEQPD1, XLXN_11265);
  or U141 (CODERWDMUXSEL1, XLXN_11271, XLXN_11270);
  and U140 (XLXN_11271, XLXN_11266, CDEQPD0);
  and U137 (XLXN_11266, CALCPTS, CDEQBRWD1, PSEL1);
  nor U129 (XLXN_11294, R2D0, RDC3, R1D3);
  fd4ce U131 (
    .C(SYSCLK), .CE(GETCODE), .CLR(CLRRDREGS), .D0(XLXN_11292), .D1(R1D3), .D2(RDC3), .D3(R2D0), .Q0(CODE4),
    .Q1(CODE5), .Q2(CODE6), .Q3(CODE7));
  or U130 (XLXN_11292, XLXN_11294, R2D1);
  or U127 (XLXN_11310, XLXN_11295, R1D1);
  nor U126 (XLXN_11295, R1D0, RDC1, R2D2);
  fd4ce U128 (
    .C(SYSCLK), .CE(GETCODE), .CLR(CLRRDREGS), .D0(XLXN_11310), .D1(R2D2), .D2(RDC1), .D3(R1D0), .Q0(CODE0),
    .Q1(CODE1), .Q2(CODE2), .Q3(CODE3));
  comp4 U134 (
    .A0(CODE0), .A1(CODE1), .A2(CODE2), .A3(CODE3), .B0(DISP0), .B1(DISP1), .B2(DISP2), .B3(DISP3),
    .EQ(CDEQPD0));
  comp4 U132 (
    .A0(CODE0), .A1(CODE1), .A2(CODE2), .A3(CODE3), .B0(BRWD0), .B1(BRWD1), .B2(BRWD2), .B3(BRWD3),
    .EQ(CDEQBRWD0));
  comp4 U133 (
    .A0(CODE4), .A1(CODE5), .A2(CODE6), .A3(CODE7), .B0(BRWD0), .B1(BRWD1), .B2(BRWD2), .B3(BRWD3),
    .EQ(CDEQBRWD1));
  comp4 U135 (
    .A0(CODE4), .A1(CODE5), .A2(CODE6), .A3(CODE7), .B0(DISP4), .B1(DISP5), .B2(DISP6), .B3(DISP7),
    .EQ(CDEQPD1));
  and U144 (CODERWD[2], XLXN_11347, CODE2);
  and U145 (CODERWD[1], XLXN_11347, CODE1);
  and U143 (CODERWD[7], XLXN_11347, CODE7);
  and U146 (CODERWD[0], XLXN_11347, CODE0);
  and U147 (XLXN_11347, ~ENCODERWDMUX, CODERWDMUXSEL1);  // and2b1
  or U180 (PTOVF, RWDCOT, XLXN_1802);
  comp4 U162 (
    .A0(BRWD0), .A1(BRWD1), .A2(BRWD2), .A3(BRWD3), .B0(DISP8), .B1(DISP9), .B2(DISP10), .B3(DISP11), .EQ(EQ2));
  comp4 U161 (
    .A0(BRWD0), .A1(BRWD1), .A2(BRWD2), .A3(BRWD3), .B0(DISP12), .B1(DISP13), .B2(DISP14), .B3(DISP15),
    .EQ(EQ3));
  comp4 U159 (.A0(BRWD0), .A1(BRWD1), .A2(BRWD2), .A3(BRWD3), .B0(DISP4), .B1(DISP5), .B2(DISP6), .B3(DISP7), .EQ(EQ1));
  comp4 U160 (.A0(BRWD0), .A1(BRWD1), .A2(BRWD2), .A3(BRWD3), .B0(DISP0), .B1(DISP1), .B2(DISP2), .B3(DISP3), .EQ(EQ0));
  not U175 (XLXN_1764, NSD1);
  and U177 (RWD[0], ~NSD1, ~NSD0, BRWD0);  // and3b2
  m2_1e U176 (.D0(BRWD1), .D1(BRWD0), .E(XLXN_1764), .S0(NSD0), .O(RWD[1]));
  X74_153 U174 (
    .A0(BRWD2), .A1(BRWD1), .A2(BRWD0), .A3(1'b0), .B0(BRWD3), .B1(BRWD2), .B2(BRWD1), .B3(BRWD0), .G0(1'b0),
    .G1(1'b0), .S0(NSD0), .S1(NSD1), .Y1(RWD[2]), .Y2(RWD[3]));
  and U172 (RWD[6], NSD1, NSD0, BRWD3);
  X74_153 U173 (
    .A0(1'b0), .A1(BRWD3), .A2(BRWD2), .A3(BRWD1), .B0(1'b0), .B1(1'b0), .B2(BRWD3), .B3(BRWD2), .G0(1'b0),
    .G1(1'b0), .S0(NSD0), .S1(NSD1), .Y1(RWD[4]), .Y2(RWD[5]));
  X74_153 U170 (
    .A0(RDP0EQ0), .A1(RDP1EQ0), .A2(RDP2EQ0), .A3(RDP3EQ0), .B0(RDP0EQ1), .B1(RDP1EQ1), .B2(RDP2EQ1),
    .B3(RDP3EQ1), .G0(1'b0), .G1(1'b0), .S0(ENCPSEL0), .S1(ENCPSEL1), .Y1(UNENCNSD0), .Y2(UNENCNSD1));
  m4_1e U169 (
    .D0(RDP0EQ2), .D1(RDP1EQ2), .D2(RDP2EQ2), .D3(RDP3EQ2), .E(1'b1), .S0(ENCPSEL0), .S1(ENCPSEL1),
    .O(UNENCNSD2));
  add4 U171 (
    .A0(UNENCNSD1), .A1(1'b0), .A2(1'b0), .A3(1'b0), .B0(UNENCNSD2), .B1(1'b0), .B2(1'b0), .B3(1'b0),
    .CI(UNENCNSD0), .S0(NSD0), .S1(NSD1));  // open: CO, OFL, S2, S3
  and U168 (RDP0EQ0, RDP0EQ1, EQ3);
  buf RDP0EQ2_BUF (RDP0EQ2, EQ1);
  and U167 (RDP0EQ1, RDP0EQ2, EQ2);
  buf RDP1EQ2_B (RDP1EQ2, EQ0);
  and U166 (RDP1EQ0, RDP1EQ1, EQ3);
  buf RDP1EQ1_BUF (RDP1EQ1, EQ2);
  buf RDP2EQ1_B (RDP2EQ1, EQ1);
  and U165 (RDP2EQ0, RDP2EQ1, EQ0);
  buf RDP2EQ2_BUF (RDP2EQ2, EQ3);
  and U164 (RDP3EQ0, RDP3EQ1, EQ0);
  buf RDP3EQ2_BUF (RDP3EQ2, EQ2);
  and U163 (RDP3EQ1, RDP3EQ2, EQ1);
  add8 U182 (.A({1'b0, RWD}), .B(CODERWD), .CI(1'b0), .CO(RWDCOT), .S(TOTRWD));  // open: OFL
  add8 U181 (.A(PT), .B(TOTRWD), .CI(1'b0), .CO(XLXN_1802), .S(NPT));  // open: OFL
  compm4 U198 (
    .A0(DISP0), .A1(DISP1), .A2(DISP2), .A3(DISP3), .B0(DISP4), .B1(DISP5), .B2(DISP6), .B3(DISP7),
    .LT(PD0PD1LT));  // open: GT
  compm4 U199 (
    .A0(DISP8), .A1(DISP9), .A2(DISP10), .A3(DISP11), .B0(DISP12), .B1(DISP13), .B2(DISP14), .B3(DISP15),
    .LT(PD2PD3LT));  // open: GT
  or U205 (LRGDISPPOS0, XLXN_11627, XLXN_11628);
  and U203 (XLXN_11628, ~LRGDISPPOS1, PD0PD1LT);  // and2b1
  and U204 (XLXN_11627, PD2PD3LT, LRGDISPPOS1);
  compm4 U202 (
    .A0(XLXN_11610), .A1(XLXN_11623), .A2(XLXN_11624), .A3(XLXN_11625), .B0(XLXN_11644), .B1(XLXN_11645),
    .B2(XLXN_11646), .B3(XLXN_11612), .LT(LRGDISPPOS1));  // open: GT
  nor U208 (POS3ZERO, DISP15, DISP14, DISP13, DISP12);
  nor U209 (POS2ZERO, DISP11, DISP10, DISP9, DISP8);
  nor U207 (POS0ZERO, DISP3, DISP2, DISP1, DISP0);
  nor U206 (POS1ZERO, DISP7, DISP6, DISP5, DISP4);
  or U210 (APOSZERO, POS3ZERO, POS2ZERO, POS1ZERO, POS0ZERO);
  and U212 (XLXN_11673, ~POS0ZERO, POS1ZERO);  // and2b1
  or U214 (ZERODISP0, XLXN_11675, XLXN_11673);
  and U213 (XLXN_11675, ~POS0ZERO, ~POS2ZERO);  // and2b2
  and U211 (ZERODISP1, ~POS0ZERO, ~POS1ZERO);  // and2b2
  and U216 (STCODE0, PSEL0, DUMMY_2);
  or U215 (DUMMY_2, CODERWD[7], CODERWD[6], CODERWD[5], CODERWD[4], CODERWD[3]);
  and U217 (STCODE1, DUMMY_2, PSEL1);
  or U219 (CODEPOS0, P2CODE3, P2CODE2, P2CODE1, P2CODE0);
  fd4ce U220 (
    .C(SYSCLK), .CE(STCODE1), .CLR(CLEAR), .D0(BRWD0), .D1(BRWD1), .D2(BRWD2), .D3(BRWD3), .Q0(P2CODE4),
    .Q1(P2CODE5), .Q2(P2CODE6), .Q3(P2CODE7));
  or U221 (CODEPOS1, P2CODE7, P2CODE6, P2CODE5, P2CODE4);
  fd4ce U218 (
    .C(SYSCLK), .CE(STCODE0), .CLR(CLEAR), .D0(BRWD0), .D1(BRWD1), .D2(BRWD2), .D3(BRWD3), .Q0(P2CODE0),
    .Q1(P2CODE1), .Q2(P2CODE2), .Q3(P2CODE3));
  and U222 (XLXN_11808, TESTP2SEL0, CODEPOS0);
  or U224 (CODEKNOWN, XLXN_11809, XLXN_11808);
  comp4 U226 (
    .A0(BRWD0), .A1(BRWD1), .A2(BRWD2), .A3(BRWD3), .B0(P2SELCD0), .B1(P2SELCD1), .B2(P2SELCD2),
    .B3(P2SELCD3), .EQ(DIGEQCD));
  fd4ce U227 (
    .C(P2CLK), .CE(STDIGEQCD), .CLR(CLEARP2FFS), .D0(ENCPOSN0), .D1(TESTADD), .D2(DIGEQCD), .D3(1'b0),
    .Q0(DIGEQCDPOSSEL0), .Q1(DIGEQCDADD), .Q2(BRWDEQCD));  // open: Q3
  and U223 (XLXN_11809, TESTP2SEL1, CODEPOS1);
  title #(.NameFieldText("Haldun Hadimioglu - Vivek S. Pujeri"), .TitleFieldText("Ppm Control Unit")) XLXI_1261 ();
  title #(.TitleFieldText("Ppm Input/output Block"), .NameFieldText("Haldun Hadimioglu - Vivek S. Pujeri")) XLXI_1267 ();
  title #(.TitleFieldText("Ppm Play Check Block"), .NameFieldText("Haldun Hadimioglu - Vivek S. Pujeri")) XLXI_1264 ();
  title #(.TitleFieldText("Ppm Points Calculation Block"), .NameFieldText("Haldun Hadimioglu - Vivek S. Pujeri")) XLXI_1265 ();
  X74_153 U82 (
    .A0(DISP6), .A1(P1PT[6]), .A2(R2D2), .A3(P2CODE6), .B0(DISP7), .B1(P1PT[7]), .B2(R2D3), .B3(P2CODE7),
    .G0(1'b0), .G1(1'b0), .S0(DISPSEL0), .S1(DISPSEL1), .Y1(DDISP6), .Y2(DDISP7));
  X74_157 U80 (
    .A0(DISP12), .A1(DISP13), .A2(DISP14), .A3(DISP15), .B0(P2PT[4]), .B1(P2PT[5]), .B2(P2PT[6]),
    .B3(P2PT[7]), .G(1'b0), .S(DISPSEL0), .Y0(DDISP12), .Y3(DDISP15), .Y1(DDISP13), .Y2(DDISP14));
  X74_157 U81 (
    .A0(DISP8), .A1(DISP9), .A2(DISP10), .A3(DISP11), .B0(P2PT[0]), .B1(P2PT[1]), .B2(P2PT[2]), .B3(P2PT[3]),
    .G(1'b0), .S(DISPSEL0), .Y0(DDISP8), .Y3(DDISP11), .Y1(DDISP9), .Y2(DDISP10));
  X74_157 U142 (
    .A0(BRWD0), .A1(BRWD1), .A2(BRWD2), .A3(BRWD3), .B0(CODE3), .B1(CODE4), .B2(CODE5), .B3(CODE6),
    .G(ENCODERWDMUX), .S(CODERWDMUXSEL1), .Y0(CODERWD[3]), .Y3(CODERWD[6]), .Y1(CODERWD[4]), .Y2(CODERWD[5]));
  X74_157 U152 (
    .A0(P1SEL[0]), .A1(P1SEL[1]), .A2(P1SEL[2]), .A3(P1SEL[3]), .B0(P2SEL0), .B1(P2SEL1), .B2(P2SEL2),
    .B3(P2SEL3), .G(1'b0), .S(SELPLYR), .Y0(PSEL0), .Y3(PSEL3), .Y1(PSEL1), .Y2(PSEL2));
  X74_157 U158 (
    .A0(RD0), .A1(RD1), .A2(RD2), .A3(RD3), .B0(NPSELDISP0), .B1(NPSELDISP1), .B2(NPSELDISP2),
    .B3(NPSELDISP3), .G(1'b0), .S(ADD), .Y0(BRWD0), .Y3(BRWD3), .Y1(BRWD1), .Y2(BRWD2));
  X74_157 U178 (
    .A0(P1PT[4]), .A1(P1PT[5]), .A2(P1PT[6]), .A3(P1PT[7]), .B0(P2PT[4]), .B1(P2PT[5]), .B2(P2PT[6]),
    .B3(P2PT[7]), .G(1'b0), .S(SELPLYR), .Y0(PT[4]), .Y3(PT[7]), .Y1(PT[5]), .Y2(PT[6]));
  X74_157 U179 (
    .A0(P1PT[0]), .A1(P1PT[1]), .A2(P1PT[2]), .A3(P1PT[3]), .B0(P2PT[0]), .B1(P2PT[1]), .B2(P2PT[2]),
    .B3(P2PT[3]), .G(1'b0), .S(SELPLYR), .Y0(PT[0]), .Y3(PT[3]), .Y1(PT[1]), .Y2(PT[2]));
  X74_157 U200 (
    .A0(DISP0), .A1(DISP1), .A2(DISP2), .A3(DISP3), .B0(DISP4), .B1(DISP5), .B2(DISP6), .B3(DISP7), .G(1'b0),
    .S(PD0PD1LT), .Y0(XLXN_11610), .Y3(XLXN_11625), .Y1(XLXN_11623), .Y2(XLXN_11624));
  X74_157 U201 (
    .A0(DISP8), .A1(DISP9), .A2(DISP10), .A3(DISP11), .B0(DISP12), .B1(DISP13), .B2(DISP14), .B3(DISP15),
    .G(1'b0), .S(PD2PD3LT), .Y0(XLXN_11644), .Y3(XLXN_11612), .Y1(XLXN_11645), .Y2(XLXN_11646));
  X74_157 U225 (
    .A0(P2CODE0), .A1(P2CODE1), .A2(P2CODE2), .A3(P2CODE3), .B0(P2CODE4), .B1(P2CODE5), .B2(P2CODE6),
    .B3(P2CODE7), .G(ENCPOSN1), .S(ENCPOSN0), .Y0(P2SELCD0), .Y3(P2SELCD3), .Y1(P2SELCD1), .Y2(P2SELCD2));
  title #(.TitleFieldText("Ppm Human Play Block"), .NameFieldText("Haldun Hadimioglu - Vivek S. Pujeri")) XLXI_1286 ();
  X74_157 XLXI_1287 (
    .A0(R0D0), .A1(R0D1), .A2(R0D2), .A3(R0D3), .B0(P1ADD), .B1(TRD1), .B2(TRD2), .B3(TRD3), .G(1'b0),
    .S(XLXN_1346), .Y0(RD0), .Y3(RD3), .Y1(RD1), .Y2(RD2));
  title #(.TitleFieldText("Ppm Machine Play Block"), .NameFieldText("Haldun Hadimioglu - Vivek S. Pujeri")) XLXI_1288 ();
  title #(.TitleFieldText("FPGA Input/output Block"), .NameFieldText("Haldun Hadimioglu - Vivek S. Pujeri")) XLXI_1289 ();
  ibuf XLXI_1294 (.I(TRD3_NP2B), .O(TRD3));
  ibuf XLXI_1295 (.I(TRD2_NP2B), .O(TRD2));
  ibuf XLXI_1296 (.I(TRD1_NP2B), .O(TRD1));
  ibuf XLXI_1298 (.I(P1PLAY_NP2B), .O(P1PLAY));
  ibuf XLXI_1299 (.I(P2PLAY_NP2B), .O(P2PLAY));
  ibuf XLXI_1300 (.I(RESET_NP2B), .O(RESET));
  ibuf XLXI_1301 (.I(SHPTS_NP2B), .O(SHPTS));
  ibuf XLXI_1302 (.I(CLOCK_NP2B), .O(CLOCK_B2B));
  obuf XLXI_1303 (.I(RD3), .O(RD3_NB2P));
  obuf XLXI_1304 (.I(RD2), .O(RD2_NB2P));
  obuf XLXI_1305 (.I(RD1), .O(RD1_NB2P));
  obuf XLXI_1306 (.I(RD0), .O(RD0_NB2P));
  obuf XLXI_1307 (.I(ADD), .O(ADD_NB2P));
  obuf XLXI_1308 (.I(STR2), .O(STR2_NB2P));
  obuf XLXI_1309 (.I(STR1), .O(STR1_NB2P));
  obuf XLXI_1310 (.I(STR0), .O(STR0_NB2P));
  obuf XLXI_1315 (.I(SBUS[0]), .O(CG_NB2P));
  obuf XLXI_1316 (.I(SBUS[1]), .O(CF_NB2P));
  obuf XLXI_1317 (.I(SBUS[2]), .O(CE_NB2P));
  obuf XLXI_1318 (.I(SBUS[3]), .O(CD_NB2P));
  obuf XLXI_1319 (.I(SBUS[4]), .O(CC_NB2P));
  obuf XLXI_1320 (.I(SBUS[5]), .O(CB_NB2P));
  obuf XLXI_1321 (.I(SBUS[6]), .O(CA_NB2P));
  obuf XLXI_1512 (.I(XLXN_12043), .O(A7_NB2P));
  obuf XLXI_1511 (.I(XLXN_12042), .O(A6_NB2P));
  obuf XLXI_1510 (.I(XLXN_12041), .O(A5_NB2P));
  obuf XLXI_1509 (.I(XLXN_12049), .O(A4_NB2P));
  obuf XLXI_1314 (.I(DISPEN[3]), .O(A3_NB2P));
  obuf XLXI_1311 (.I(DISPEN[2]), .O(A2_NB2P));
  obuf XLXI_1312 (.I(DISPEN[1]), .O(A1_NB2P));
  obuf XLXI_1313 (.I(DISPEN[0]), .O(A0_NB2P));
  or U88 (XLXN_203, ~BPDS, Q[8]);  // or2b1
  and U89 (INT_NET0, XLXN_203, XLXN_202);
  or U92 (XLXN_181, ~LPSEL0, INT_NET0);  // or2b1
  or U94 (XLXN_195, ~LPSEL1, INT_NET0);  // or2b1
  or U96 (XLXN_194, ~LPSEL2, INT_NET0);  // or2b1
  or U98 (XLXN_193, ~LPSEL3, INT_NET0);  // or2b1
  nand U95 (DISPEN[1], DCDEN1, XLXN_195);
  nand U97 (DISPEN[2], DCDEN2, XLXN_194);
  nand U99 (DISPEN[3], DCDEN3, XLXN_193);
  nand U93 (DISPEN[0], DCDEN0, XLXN_181);
  or U87 (XLXN_202, ~BPDF, Q[6]);  // or2b1
  cb4ce XLXI_1513 (.C(Q[0]), .CE(1'b1), .CLR(1'b0), .Q0(MC0), .Q1(MC1), .Q2(MC2));  // open: CEO, Q3, TC
  or U90 (XLXN_210, ~LPTOVF, Q[8]);  // or2b1
  m8_1e XLXI_1542 (
    .D0(DDISP1), .D1(DDISP5), .D2(DDISP9), .D3(DDISP13), .D4(P1PT[1]), .D5(P1PT[5]), .D6(P2PT[1]),
    .D7(P2PT[5]), .E(1'b1), .S0(MC0), .S1(MC1), .S2(MC2), .O(KSBUS[1]));
  m8_1e XLXI_1543 (
    .D0(DDISP3), .D1(DDISP7), .D2(DDISP11), .D3(DDISP15), .D4(P1PT[3]), .D5(P1PT[7]), .D6(P2PT[3]),
    .D7(P2PT[7]), .E(1'b1), .S0(MC0), .S1(MC1), .S2(MC2), .O(KSBUS[3]));
  m8_1e XLXI_1544 (
    .D0(DDISP0), .D1(DDISP4), .D2(DDISP8), .D3(DDISP12), .D4(P1PT[0]), .D5(P1PT[4]), .D6(P2PT[0]),
    .D7(P2PT[4]), .E(1'b1), .S0(MC0), .S1(MC1), .S2(MC2), .O(KSBUS[0]));
  m8_1e XLXI_1545 (
    .D0(DDISP2), .D1(DDISP6), .D2(DDISP10), .D3(DDISP14), .D4(P1PT[2]), .D5(P1PT[6]), .D6(P2PT[2]),
    .D7(P2PT[6]), .E(1'b1), .S0(MC0), .S1(MC1), .S2(MC2), .O(KSBUS[2]));
  bufg CLOCK_BUFG (.I(CLOCK_B2B), .O(CLOCK));
  d3_8e XLXI_1564 (
    .A0(MC0), .A1(MC1), .A2(MC2), .E(XLXN_210), .D0(DCDEN0), .D1(DCDEN1), .D2(DCDEN2), .D3(DCDEN3),
    .D4(DCDEN4), .D5(DCDEN5), .D6(DCDEN6), .D7(DCDEN7));
  not XLXI_1576 (XLXN_12042, DCDEN6);
  not XLXI_1577 (XLXN_12043, DCDEN7);
  not XLXI_1575 (XLXN_12041, DCDEN5);
  not XLXI_1566 (XLXN_12049, DCDEN4);
  buf XLXI_1723 (mp_gpi1[14], DISP14);
  buf XLXI_1724 (mp_gpi1[13], DISP13);
  buf XLXI_1725 (mp_gpi1[15], DISP15);
  buf XLXI_1726 (mp_gpi1[12], DISP12);
  buf XLXI_1727 (mp_gpi1[10], DISP10);
  buf XLXI_1728 (mp_gpi1[9], DISP9);
  buf XLXI_1729 (mp_gpi1[11], DISP11);
  buf XLXI_1730 (mp_gpi1[8], DISP8);
  buf XLXI_1731 (mp_gpi1[6], DISP6);
  buf XLXI_1732 (mp_gpi1[5], DISP5);
  buf XLXI_1733 (mp_gpi1[7], DISP7);
  buf XLXI_1734 (mp_gpi1[4], DISP4);
  buf XLXI_1735 (mp_gpi1[2], DISP2);
  buf XLXI_1736 (mp_gpi1[1], DISP1);
  buf XLXI_1737 (mp_gpi1[3], DISP3);
  buf XLXI_1738 (mp_gpi1[0], DISP0);
  buf XLXI_1814 (mp_gpi2[6], P1PT[6]);
  buf XLXI_1815 (mp_gpi2[5], P1PT[5]);
  buf XLXI_1816 (mp_gpi2[7], P1PT[7]);
  buf XLXI_1817 (mp_gpi2[4], P1PT[4]);
  buf XLXI_1818 (mp_gpi2[2], P1PT[2]);
  buf XLXI_1819 (mp_gpi2[1], P1PT[1]);
  buf XLXI_1820 (mp_gpi2[3], P1PT[3]);
  buf XLXI_1821 (mp_gpi2[0], P1PT[0]);
  buf XLXI_1822 (mp_gpi2[14], P2PT[6]);
  buf XLXI_1823 (mp_gpi2[13], P2PT[5]);
  buf XLXI_1824 (mp_gpi2[15], P2PT[7]);
  buf XLXI_1825 (mp_gpi2[12], P2PT[4]);
  buf XLXI_1826 (mp_gpi2[10], P2PT[2]);
  buf XLXI_1827 (mp_gpi2[9], P2PT[1]);
  buf XLXI_1828 (mp_gpi2[11], P2PT[3]);
  buf XLXI_1829 (mp_gpi2[8], P2PT[0]);
  buf XLXI_1830 (mp_gpi2[17], P1PLAYED);
  buf XLXI_1831 (mp_gpi2[21], P1SEL[3]);
  buf XLXI_1832 (mp_gpi2[16], P1ADD);
  buf XLXI_1833 (mp_gpi2[20], P1SEL[2]);
  buf XLXI_1834 (mp_gpi2[18], P1SEL[0]);
  buf XLXI_1835 (mp_gpi2[22], P1SKIP);
  buf XLXI_1836 (mp_gpi2[19], P1SEL[1]);
  buf XLXI_1838 (mp_gpi2[24], P2PLAYED);
  buf XLXI_1839 (mp_gpi2[28], P2SEL3);
  buf XLXI_1840 (mp_gpi2[23], P2ADD);
  buf XLXI_1841 (mp_gpi2[27], P2SEL2);
  buf XLXI_1842 (mp_gpi2[25], P2SEL0);
  buf XLXI_1843 (mp_gpi2[29], P2SKIP);
  buf XLXI_1844 (mp_gpi2[26], P2SEL1);
  buf XLXI_1329 (mp_gpi1[16], RD0);
  buf XLXI_1328 (mp_gpi1[17], RD1);
  buf XLXI_1327 (mp_gpi1[18], RD2);
  buf XLXI_1722 (mp_gpi1[19], RD3);
  buf XLXI_1345 (mp_gpi1[20], S0);
  buf XLXI_1344 (mp_gpi1[21], S1);
  buf XLXI_1343 (mp_gpi1[22], S2);
  buf XLXI_1342 (mp_gpi1[23], S3);
  buf XLXI_1341 (mp_gpi1[24], S4);
  buf XLXI_1340 (mp_gpi1[25], S5);
  buf XLXI_1339 (mp_gpi1[26], S6);
  buf XLXI_1812 (mp_gpi1[27], SYSCLK);
  buf XLXI_1813 (mp_gpi1[28], P2CLK);
  buf XLXI_1920 (mp_gpi2[30], NSD0);
  buf XLXI_1919 (mp_gpi2[31], NSD1);
  mcs_io mcs_1 (
    .clk(CLOCK), .reset(1'b0), .uart_tx(UART_TX), .uart_rx(UART_RX), .gpi1(mcs_io_rx), .gpo1(mcs_io_tx));  // open: uart_interrupt, gpi2, gpi3, gpi4, gpo2, gpo3, gpo4, intc_irq
  buf XLXI_1331 (P1ADD, mp_gpo1[0]);
  buf XLXI_1332 (P1PLAYED, mp_gpo1[1]);
  buf XLXI_1335 (P1SEL[2], mp_gpo1[4]);
  buf XLXI_1337 (P1SEL[0], mp_gpo1[2]);
  buf XLXI_1338 (P1SKIP, mp_gpo1[6]);
  buf XLXI_1333 (P1SEL[3], mp_gpo1[5]);
  buf XLXI_1336 (P1SEL[1], mp_gpo1[3]);
  mcs_machine_player mcs_0 (
    .clk(CLOCK), .reset(1'b0), .gpi1(mp_gpi1), .gpi2(mp_gpi2), .gpi3(mp_gpi3), .gpi4(mcs_io_tx),
    .gpo1(mp_gpo1), .gpo4(mcs_io_rx));  // open: gpo2, gpo3
  buf XLXI_1936 (mp_gpi3[6], RWD[6]);
  buf XLXI_1937 (mp_gpi3[5], RWD[5]);
  buf XLXI_1938 (mp_gpi3[7], 1'b0);
  buf XLXI_1939 (mp_gpi3[4], RWD[4]);
  buf XLXI_1940 (mp_gpi3[2], RWD[2]);
  buf XLXI_1941 (mp_gpi3[1], RWD[1]);
  buf XLXI_1942 (mp_gpi3[3], RWD[3]);
  buf XLXI_1943 (mp_gpi3[0], RWD[0]);
  buf XLXI_1944 (P1PLAYSYNCH_MCS, mp_gpo1[7]);
  buf XLXI_1945 (P2PLAYSYNCH_MCS, mp_gpo1[8]);
  fdc U72 (.C(RDCLK), .CLR(1'b0), .D(P2PLAY), .Q(XLXN_10484));
  fdc U74 (.C(SYSCLK), .CLR(1'b0), .D(XLXN_10482), .Q(XLXN_10495));
  fdc U73 (.C(P2CLK), .CLR(1'b0), .D(XLXN_10484), .Q(XLXN_10482));
  fdc U76 (.C(RDCLK), .CLR(1'b0), .D(P1PLAY), .Q(XLXN_10962));
  and U79 (XLXN_12317, ~XLXN_10960, XLXN_10958, XLXN_10962);  // and3b1
  fdc U77 (.C(P2CLK), .CLR(1'b0), .D(XLXN_10962), .Q(XLXN_10958));
  fdc U78 (.C(SYSCLK), .CLR(1'b0), .D(XLXN_10958), .Q(XLXN_10960));
  and U75 (XLXN_12282, ~XLXN_10495, XLXN_10482, XLXN_10484);  // and3b1
  or XLXI_1946 (P2PLAYSYNCH, XLXN_12282, P2PLAYSYNCH_MCS);
  or XLXI_1959 (P1PLAYSYNCH, XLXN_12317, P1PLAYSYNCH_MCS);

  // Notes on the sheet:
  //   Control Signal Generation
  //   Next State Generation
  //   Latching Subsubblock
  //   Clock Signal Generation Subsubblock
  //   Timing Subblock
  //   Debouncing Subsubblock
  //   7-Segment Digit Content Selection Subsubblock
  //   Display Subblock
  //   7-Segment Digit Control Subsubblock
  //   7-Segment Digit Selection Subsubblock
  //   Hex-to-7-Segment Converter Subsubblock
  //   Player's Points Storage Subsubblock
  //   Random Digit Generation Subsubblock
  //   Position Display Storage Subsubblock
  //   Points Display, Points Storage and Random Number Generation Subblock
  //   Display Add and Compare Subblock
  //   Adding RD to the Displays Subsubblock
  //   Code Storage and Code Reward Calculation Subsubblock
  //   Player 1-2 Multiplexing Subsubblock
  //   Select Digit to Store Subsubblock
  //   Select Compare Result Subsubblock
  //   Play Digit Determination Subblock
  //   Adjacency Subblock
  //   Encoded Adjacency Subsubblock
  //   Unencoded Adjacency Subsubblock
  //   Adjacent Similar Digit Subsubblock
  //   Equality Check Subsubblock
  //   Regular Reward Calculation Subblock
  //   Points Subblock
  //   Select Player Points Subblock
  //   POINTS ADDITION SUB-BLOCK
  //   Decision Making Subblock
  //   Control Signal Generation
  //   Information Gathering Subblock
  //   Sequencing Subblock
  //   Next State Generation
  //   I/O BUFFER SUB-BLOCK
  //   I/O PADs
endmodule
